# EAGLE design gf130_v2 (EAGLE 9.5.2)
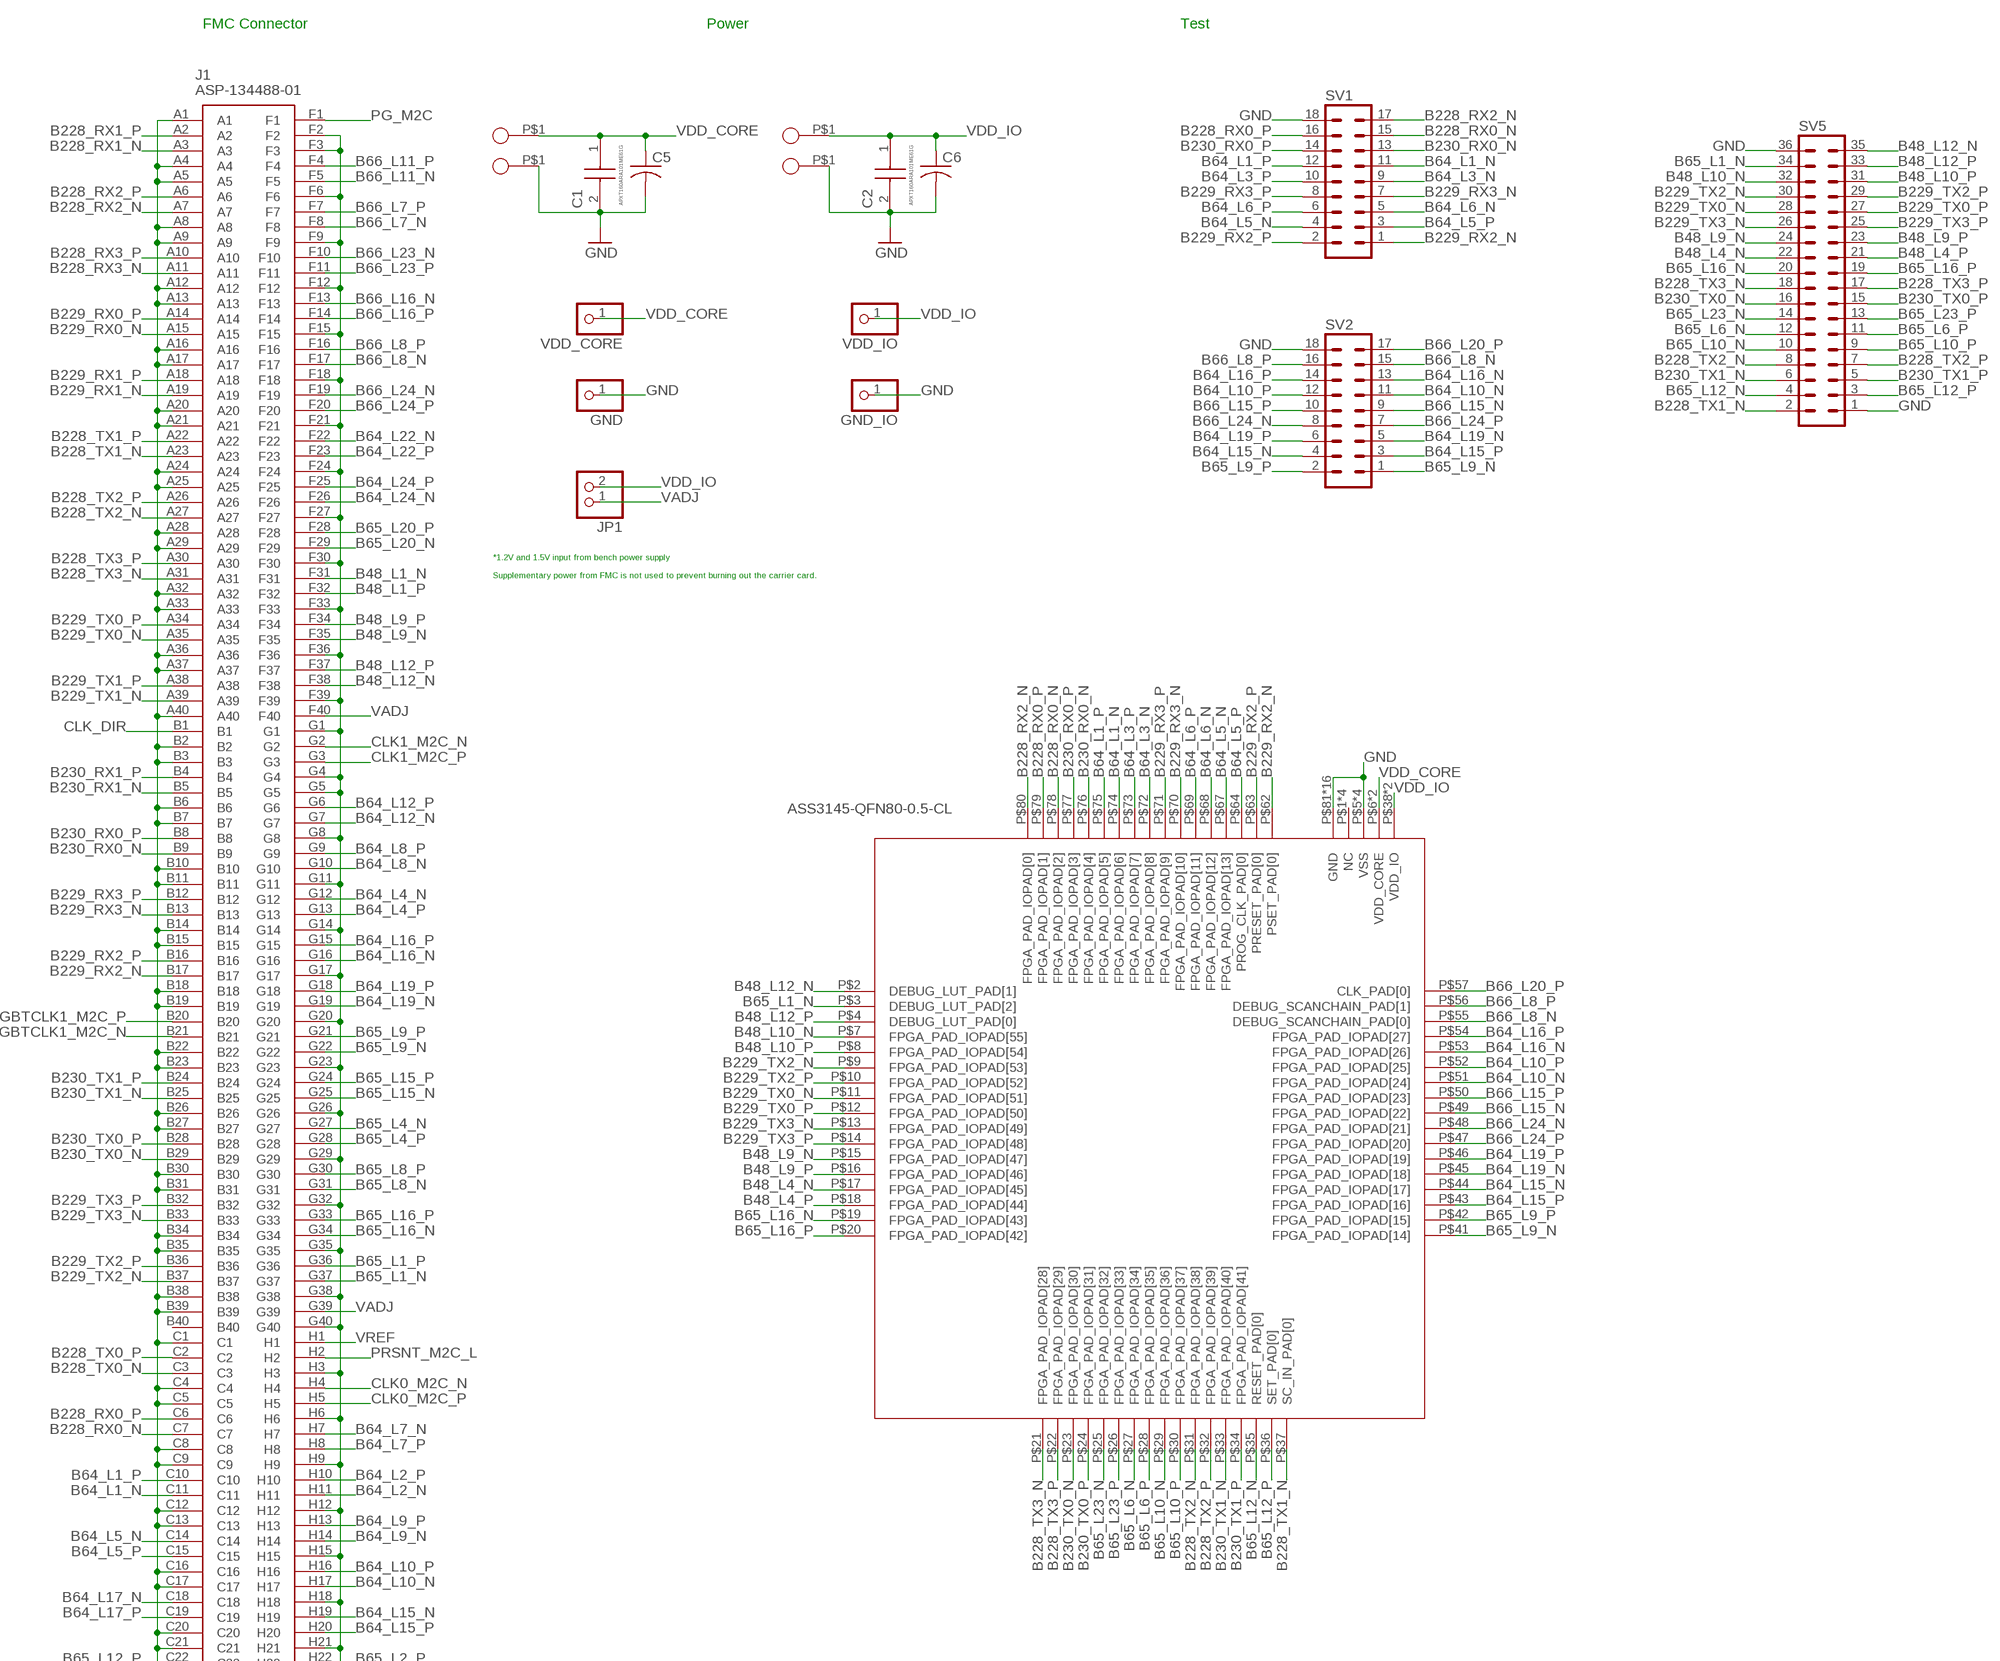
[diagram p0: schematic, sheet 1, part 1 of 2]
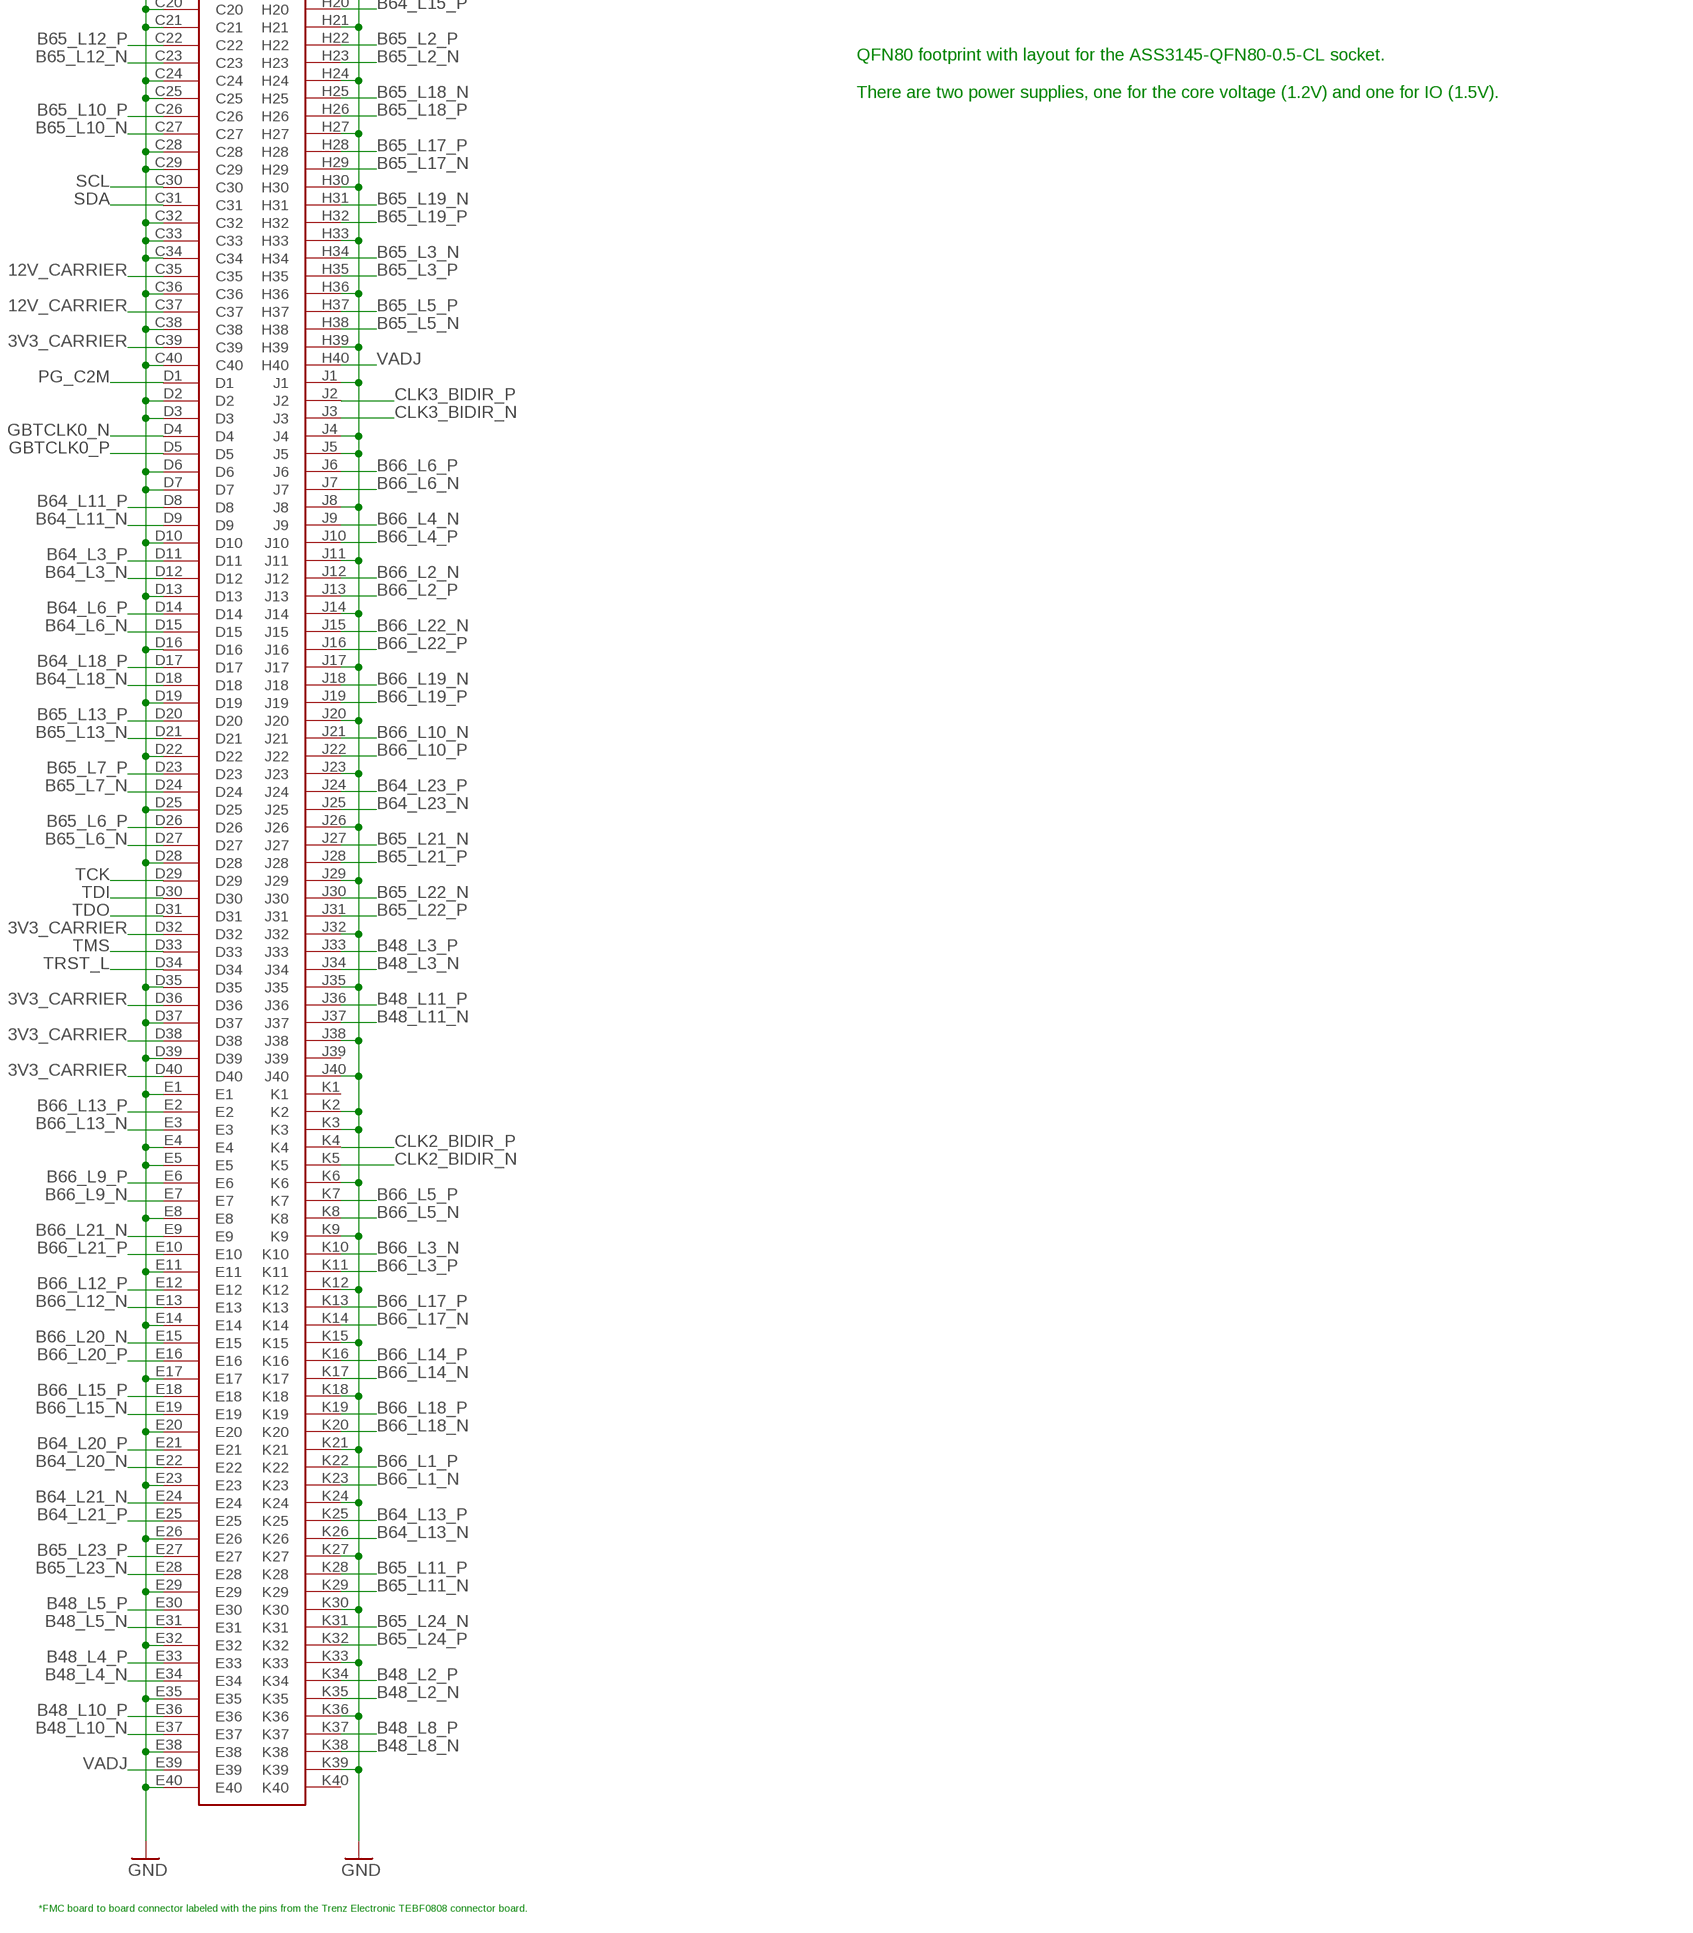
[diagram p1: schematic, sheet 1, part 2 of 2]

## Parts
C1  APXT160ARA101ME61G  [CAPAE530X610N]
C2  APXT160ARA101ME61G  [CAPAE530X610N]
C5  C-USC0805K  [C0805K]
C6  C-USC0805K  [C0805K]
GND  PINHD-1X1  [1X01]
GND_IO  PINHD-1X1  [1X01]
J1  ASP-134488-01  [ASP13448801]
JP1  PINHD-1X2  [1X02]
SV1  MA09-2  [MA09-2]
SV2  MA09-2  [MA09-2]
SV5  MA18-2  [MA18-2]
U$2  QFN80  [GF130]
U$3  BANANA_JACK  [73099]
U$4  BANANA_JACK  [73099]
U$5  BANANA_JACK  [73099]
VDD  BANANA_JACK  [73099]
VDD_CORE  PINHD-1X1  [1X01]
VDD_IO  PINHD-1X1  [1X01]

## Nets
3V3_CARRIER: J1.C39 J1.D32 J1.D36 J1.D38 J1.D40
12V_CARRIER: J1.C35 J1.C37
B48_L1_N: J1.F31
B48_L1_P: J1.F32
B48_L2_N: J1.K35
B48_L2_P: J1.K34
B48_L3_N: J1.J34
B48_L3_P: J1.J33
B48_L4_N: J1.E34 SV5.22 U$2.P$17(FPGA_PAD_IOPAD[45])
B48_L4_P: J1.E33 SV5.21 U$2.P$18(FPGA_PAD_IOPAD[44])
B48_L5_N: J1.E31
B48_L5_P: J1.E30
B48_L8_N: J1.K38
B48_L8_P: J1.K37
B48_L9_N: J1.F35 SV5.24 U$2.P$15(FPGA_PAD_IOPAD[47])
B48_L9_P: J1.F34 SV5.23 U$2.P$16(FPGA_PAD_IOPAD[46])
B48_L10_N: J1.E37 SV5.32 U$2.P$7(FPGA_PAD_IOPAD[55])
B48_L10_P: J1.E36 SV5.31 U$2.P$8(FPGA_PAD_IOPAD[54])
B48_L11_N: J1.J37
B48_L11_P: J1.J36
B48_L12_N: J1.F38 SV5.35 U$2.P$2(DEBUG_LUT_PAD[1])
B48_L12_P: J1.F37 SV5.33 U$2.P$4(DEBUG_LUT_PAD[0])
B64_L1_N: J1.C11 SV1.11 U$2.P$74(FPGA_PAD_IOPAD[6])
B64_L1_P: J1.C10 SV1.12 U$2.P$75(FPGA_PAD_IOPAD[5])
B64_L2_N: J1.H11
B64_L2_P: J1.H10
B64_L3_N: J1.D12 SV1.9 U$2.P$72(FPGA_PAD_IOPAD[8])
B64_L3_P: J1.D11 SV1.10 U$2.P$73(FPGA_PAD_IOPAD[7])
B64_L4_N: J1.G12
B64_L4_P: J1.G13
B64_L5_N: J1.C14 SV1.4 U$2.P$67(FPGA_PAD_IOPAD[13])
B64_L5_P: J1.C15 SV1.3 U$2.P$64(PROG_CLK_PAD[0])
B64_L6_N: J1.D15 SV1.5 U$2.P$68(FPGA_PAD_IOPAD[12])
B64_L6_P: J1.D14 SV1.6 U$2.P$69(FPGA_PAD_IOPAD[11])
B64_L7_N: J1.H7
B64_L7_P: J1.H8
B64_L8_N: J1.G10
B64_L8_P: J1.G9
B64_L9_N: J1.H14
B64_L9_P: J1.H13
B64_L10_N: J1.H17 SV2.11 U$2.P$51(FPGA_PAD_IOPAD[24])
B64_L10_P: J1.H16 SV2.12 U$2.P$52(FPGA_PAD_IOPAD[25])
B64_L11_N: J1.D9
B64_L11_P: J1.D8
B64_L12_N: J1.G7
B64_L12_P: J1.G6
B64_L13_N: J1.K26
B64_L13_P: J1.K25
B64_L15_N: J1.H19 SV2.4 U$2.P$44(FPGA_PAD_IOPAD[17])
B64_L15_P: J1.H20 SV2.3 U$2.P$43(FPGA_PAD_IOPAD[16])
B64_L16_N: J1.G16 SV2.13 U$2.P$53(FPGA_PAD_IOPAD[26])
B64_L16_P: J1.G15 SV2.14 U$2.P$54(FPGA_PAD_IOPAD[27])
B64_L17_N: J1.C18
B64_L17_P: J1.C19
B64_L18_N: J1.D18
B64_L18_P: J1.D17
B64_L19_N: J1.G19 SV2.5 U$2.P$45(FPGA_PAD_IOPAD[18])
B64_L19_P: J1.G18 SV2.6 U$2.P$46(FPGA_PAD_IOPAD[19])
B64_L20_N: J1.E22
B64_L20_P: J1.E21
B64_L21_N: J1.E24
B64_L21_P: J1.E25
B64_L22_N: J1.F22
B64_L22_P: J1.F23
B64_L23_N: J1.J25
B64_L23_P: J1.J24
B64_L24_N: J1.F26
B64_L24_P: J1.F25
B65_L1_N: J1.G37 SV5.34 U$2.P$3(DEBUG_LUT_PAD[2])
B65_L1_P: J1.G36
B65_L2_N: J1.H23
B65_L2_P: J1.H22
B65_L3_N: J1.H34
B65_L3_P: J1.H35
B65_L4_N: J1.G27
B65_L4_P: J1.G28
B65_L5_N: J1.H38
B65_L5_P: J1.H37
B65_L6_N: J1.D27 SV5.12 U$2.P$27(FPGA_PAD_IOPAD[34])
B65_L6_P: J1.D26 SV5.11 U$2.P$28(FPGA_PAD_IOPAD[35])
B65_L7_N: J1.D24
B65_L7_P: J1.D23
B65_L8_N: J1.G31
B65_L8_P: J1.G30
B65_L9_N: J1.G22 SV2.1 U$2.P$41(FPGA_PAD_IOPAD[14])
B65_L9_P: J1.G21 SV2.2 U$2.P$42(FPGA_PAD_IOPAD[15])
B65_L10_N: J1.C27 SV5.10 U$2.P$29(FPGA_PAD_IOPAD[36])
B65_L10_P: J1.C26 SV5.9 U$2.P$30(FPGA_PAD_IOPAD[37])
B65_L11_N: J1.K29
B65_L11_P: J1.K28
B65_L12_N: J1.C23 SV5.4 U$2.P$35(RESET_PAD[0])
B65_L12_P: J1.C22 SV5.3 U$2.P$36(SET_PAD[0])
B65_L13_N: J1.D21
B65_L13_P: J1.D20
B65_L15_N: J1.G25
B65_L15_P: J1.G24
B65_L16_N: J1.G34 SV5.20 U$2.P$19(FPGA_PAD_IOPAD[43])
B65_L16_P: J1.G33 SV5.19 U$2.P$20(FPGA_PAD_IOPAD[42])
B65_L17_N: J1.H29
B65_L17_P: J1.H28
B65_L18_N: J1.H25
B65_L18_P: J1.H26
B65_L19_N: J1.H31
B65_L19_P: J1.H32
B65_L20_N: J1.F29
B65_L20_P: J1.F28
B65_L21_N: J1.J27
B65_L21_P: J1.J28
B65_L22_N: J1.J30
B65_L22_P: J1.J31
B65_L23_N: J1.E28 SV5.14 U$2.P$25(FPGA_PAD_IOPAD[32])
B65_L23_P: J1.E27 SV5.13 U$2.P$26(FPGA_PAD_IOPAD[33])
B65_L24_N: J1.K31
B65_L24_P: J1.K32
B66_L1_N: J1.K23
B66_L1_P: J1.K22
B66_L2_N: J1.J12
B66_L2_P: J1.J13
B66_L3_N: J1.K10
B66_L3_P: J1.K11
B66_L4_N: J1.J9
B66_L4_P: J1.J10
B66_L5_N: J1.K8
B66_L5_P: J1.K7
B66_L6_N: J1.J7
B66_L6_P: J1.J6
B66_L7_N: J1.F8
B66_L7_P: J1.F7
B66_L8_N: J1.F17 SV2.15 U$2.P$55(DEBUG_SCANCHAIN_PAD[0])
B66_L8_P: J1.F16 SV2.16 U$2.P$56(DEBUG_SCANCHAIN_PAD[1])
B66_L9_N: J1.E7
B66_L9_P: J1.E6
B66_L10_N: J1.J21
B66_L10_P: J1.J22
B66_L11_N: J1.F5
B66_L11_P: J1.F4
B66_L12_N: J1.E13
B66_L12_P: J1.E12
B66_L13_N: J1.E3
B66_L13_P: J1.E2
B66_L14_N: J1.K17
B66_L14_P: J1.K16
B66_L15_N: J1.E19 SV2.9 U$2.P$49(FPGA_PAD_IOPAD[22])
B66_L15_P: J1.E18 SV2.10 U$2.P$50(FPGA_PAD_IOPAD[23])
B66_L16_N: J1.F13
B66_L16_P: J1.F14
B66_L17_N: J1.K14
B66_L17_P: J1.K13
B66_L18_N: J1.K20
B66_L18_P: J1.K19
B66_L19_N: J1.J18
B66_L19_P: J1.J19
B66_L20_N: J1.E15
B66_L20_P: J1.E16 SV2.17 U$2.P$57(CLK_PAD[0])
B66_L21_N: J1.E9
B66_L21_P: J1.E10
B66_L22_N: J1.J15
B66_L22_P: J1.J16
B66_L23_N: J1.F10
B66_L23_P: J1.F11
B66_L24_N: J1.F19 SV2.8 U$2.P$48(FPGA_PAD_IOPAD[21])
B66_L24_P: J1.F20 SV2.7 U$2.P$47(FPGA_PAD_IOPAD[20])
B228_RX0_N: J1.C7 SV1.15 U$2.P$78(FPGA_PAD_IOPAD[2])
B228_RX0_P: J1.C6 SV1.16 U$2.P$79(FPGA_PAD_IOPAD[1])
B228_RX1_N: J1.A3
B228_RX1_P: J1.A2
B228_RX2_N: J1.A7 SV1.17 U$2.P$80(FPGA_PAD_IOPAD[0])
B228_RX2_P: J1.A6
B228_RX3_N: J1.A11
B228_RX3_P: J1.A10
B228_TX0_N: J1.C3
B228_TX0_P: J1.C2
B228_TX1_N: J1.A23 SV5.2 U$2.P$37(SC_IN_PAD[0])
B228_TX1_P: J1.A22
B228_TX2_N: J1.A27 SV5.8 U$2.P$31(FPGA_PAD_IOPAD[38])
B228_TX2_P: J1.A26 SV5.7 U$2.P$32(FPGA_PAD_IOPAD[39])
B228_TX3_N: J1.A31 SV5.18 U$2.P$21(FPGA_PAD_IOPAD[28])
B228_TX3_P: J1.A30 SV5.17 U$2.P$22(FPGA_PAD_IOPAD[29])
B229_RX0_N: J1.A15
B229_RX0_P: J1.A14
B229_RX1_N: J1.A19
B229_RX1_P: J1.A18
B229_RX2_N: J1.B17 SV1.1 U$2.P$62(PSET_PAD[0])
B229_RX2_P: J1.B16 SV1.2 U$2.P$63(PRESET_PAD[0])
B229_RX3_N: J1.B13 SV1.7 U$2.P$70(FPGA_PAD_IOPAD[10])
B229_RX3_P: J1.B12 SV1.8 U$2.P$71(FPGA_PAD_IOPAD[9])
B229_TX0_N: J1.A35 SV5.28 U$2.P$11(FPGA_PAD_IOPAD[51])
B229_TX0_P: J1.A34 SV5.27 U$2.P$12(FPGA_PAD_IOPAD[50])
B229_TX1_N: J1.A39
B229_TX1_P: J1.A38
B229_TX2_N: J1.B37 SV5.30 U$2.P$9(FPGA_PAD_IOPAD[53])
B229_TX2_P: J1.B36 SV5.29 U$2.P$10(FPGA_PAD_IOPAD[52])
B229_TX3_N: J1.B33 SV5.26 U$2.P$13(FPGA_PAD_IOPAD[49])
B229_TX3_P: J1.B32 SV5.25 U$2.P$14(FPGA_PAD_IOPAD[48])
B230_RX0_N: J1.B9 SV1.13 U$2.P$76(FPGA_PAD_IOPAD[4])
B230_RX0_P: J1.B8 SV1.14 U$2.P$77(FPGA_PAD_IOPAD[3])
B230_RX1_N: J1.B5
B230_RX1_P: J1.B4
B230_TX0_N: J1.B29 SV5.16 U$2.P$23(FPGA_PAD_IOPAD[30])
B230_TX0_P: J1.B28 SV5.15 U$2.P$24(FPGA_PAD_IOPAD[31])
B230_TX1_N: J1.B25 SV5.6 U$2.P$33(FPGA_PAD_IOPAD[40])
B230_TX1_P: J1.B24 SV5.5 U$2.P$34(FPGA_PAD_IOPAD[41])
CLK0_M2C_N: J1.H4
CLK0_M2C_P: J1.H5
CLK1_M2C_N: J1.G2
CLK1_M2C_P: J1.G3
CLK2_BIDIR_N: J1.K5
CLK2_BIDIR_P: J1.K4
CLK3_BIDIR_N: J1.J3
CLK3_BIDIR_P: J1.J2
CLK_DIR: J1.B1
GBTCLK0_N: J1.D4
GBTCLK0_P: J1.D5
GBTCLK1_M2C_N: J1.B21
GBTCLK1_M2C_P: J1.B20
GND: C1.2(-) C2.2(-) C5.2 C6.2 GND.1 GND_IO.1 J1.A1 J1.A4 J1.A5 J1.A8 J1.A9 J1.A12 J1.A13 J1.A16 J1.A17 J1.A20 J1.A21 J1.A24 J1.A25 J1.A28 J1.A29 J1.A32 J1.A33 J1.A36 J1.A37 J1.A40 J1.B2 J1.B3 J1.B6 J1.B7 J1.B10 J1.B11 J1.B14 J1.B15 J1.B18 J1.B19 J1.B22 J1.B23 J1.B26 J1.B27 J1.B30 J1.B31 J1.B34 J1.B35 J1.B38 J1.B39 J1.C1 J1.C4 J1.C5 J1.C8 J1.C9 J1.C12 J1.C13 J1.C16 J1.C17 J1.C20 J1.C21 J1.C24 J1.C25 J1.C28 J1.C29 J1.C32 J1.C33 J1.C34 J1.C36 J1.C38 J1.C40 J1.D2 J1.D3 J1.D6 J1.D7 J1.D10 J1.D13 J1.D16 J1.D19 J1.D22 J1.D25 J1.D28 J1.D35 J1.D37 J1.D39 J1.E1 J1.E4 J1.E5 J1.E8 J1.E11 J1.E14 J1.E17 J1.E20 J1.E23 J1.E26 J1.E29 J1.E32 J1.E35 J1.E38 J1.E40 J1.F2 J1.F3 J1.F6 J1.F9 J1.F12 J1.F15 J1.F18 J1.F21 J1.F24 J1.F27 J1.F30 J1.F33 J1.F36 J1.F39 J1.G1 J1.G4 J1.G5 J1.G8 J1.G11 J1.G14 J1.G17 J1.G20 J1.G23 J1.G26 J1.G29 J1.G32 J1.G35 J1.G38 J1.G40 J1.H3 J1.H6 J1.H9 J1.H12 J1.H15 J1.H18 J1.H21 J1.H24 J1.H27 J1.H30 J1.H33 J1.H36 J1.H39 J1.J1 J1.J4 J1.J5 J1.J8 J1.J11 J1.J14 J1.J17 J1.J20 J1.J23 J1.J26 J1.J29 J1.J32 J1.J35 J1.J38 J1.J40 J1.K2 J1.K3 J1.K6 J1.K9 J1.K12 J1.K15 J1.K18 J1.K21 J1.K24 J1.K27 J1.K30 J1.K33 J1.K36 J1.K39 SV1.18 SV2.18 SV5.1 SV5.36 U$2.P$5(VSS) U$2.P$39(VSS) U$2.P$59(VSS) U$2.P$65(VSS) U$2.P$81(GND) U$2.P$82(GND) U$2.P$83(GND) U$2.P$84(GND) U$2.P$85(GND) U$2.P$86(GND) U$2.P$87(GND) U$2.P$88(GND) U$2.P$89(GND) U$2.P$90(GND) U$2.P$91(GND) U$2.P$92(GND) U$2.P$93(GND) U$2.P$94(GND) U$2.P$95(GND) U$2.P$96(GND) U$3.P$1 U$5.P$1
PG_C2M: J1.D1
PG_M2C: J1.F1
PRSNT_M2C_L: J1.H2
SCL: J1.C30
SDA: J1.C31
TCK: J1.D29
TDI: J1.D30
TDO: J1.D31
TMS: J1.D33
TRST_L: J1.D34
VADJ: J1.E39 J1.F40 J1.G39 J1.H40 JP1.1
VDD_CORE: C1.1(+) C5.1 U$2.P$6(VDD_CORE) U$2.P$58(VDD_CORE) VDD.P$1 VDD_CORE.1
VDD_IO: C2.1(+) C6.1 JP1.2 U$2.P$38(VDD_IO) U$2.P$66(VDD_IO) U$4.P$1 VDD_IO.1
VREF: J1.H1
Unconnected: J1.B40 J1.J39 J1.K1 J1.K40 U$2.P$1(NC) U$2.P$40(NC) U$2.P$60(NC) U$2.P$61(NC)

## Notes on the sheet
- FMC Connector | Power | Test
- *1.2V and 1.5V input from bench power supply
  
  Supplementary power from FMC is not used to prevent burning out the carrier card.
- QFN80 footprint with layout for the ASS3145-QFN80-0.5-CL socket. 
  
  There are two power supplies, one for the core voltage (1.2V) and one for IO (1.5V).
- *FMC board to board connector labeled with the pins from the Trenz Electronic TEBF0808 connector board.

## Power pins joined to a net without a drawn wire
GND: U$3.P$2(GND) U$3.P$3(GND) U$3.P$4(GND) U$3.P$5(GND) U$4.P$2(GND) U$4.P$3(GND) U$4.P$4(GND) U$4.P$5(GND) U$5.P$2(GND) U$5.P$3(GND) U$5.P$4(GND) U$5.P$5(GND) VDD.P$2(GND) VDD.P$3(GND) VDD.P$4(GND) VDD.P$5(GND)

## Library data of the parts
C1 C2 = SamacSys_Parts:APXT160ARA101ME61G: Aluminum Organic Polymer Capacitors 100uF 16V Source: Datasheet; DESCRIPTION: Aluminum Organic Polymer Capacitors 100uF 16V; HEIGHT: 6.1mm; MANUFACTURER_NAME: United Chemi-Con; MANUFACTURER_PART_NUMBER: APXT160ARA101ME61G; MOUSER_PART_NUMBER: 661-APXT160A101ME61G; MOUSER_PRICE-STOCK: https://www.mouser.co.uk/ProductDetail/United-Chemi-Con/APXT160ARA101ME61G?qs=GBLSl2Akirsip577GuQBxg%3D%3D
C5 C6 = rcl:C-US: CAPACITOR, American symbol; SPICEPREFIX: C
GND GND_IO VDD_CORE VDD_IO = pinhead:PINHD-1X1: PIN HEADER
J1 = SamacSys_Parts:ASP-134488-01: SAMTEC - ASP-134488-01 - CONN, VITA 57 FMC, HEADER, 400POS, 10ROW Source: Datasheet <http://suddendocs.samtec.com/prints/asp-134488-01-mkt.pdf>; DESCRIPTION: SAMTEC - ASP-134488-01 - CONN, VITA 57 FMC, HEADER, 400POS, 10ROW; HEIGHT: 7.11mm; MANUFACTURER_NAME: SAMTEC; MANUFACTURER_PART_NUMBER: ASP-134488-01; MOUSER_PART_NUMBER: 200-ASP-134488-01; MOUSER_PRICE-STOCK: https://www.mouser.co.uk/ProductDetail/Samtec/ASP-134488-01?qs=jyzYFa4oMQiB2Frr%252B13AUg%3D%3D
JP1 = pinhead:PINHD-1X2: PIN HEADER
SV1 SV2 = con-lstb:MA09-2: PIN HEADER; OC_FARNELL: unknown; OC_NEWARK: unknown
SV5 = con-lstb:MA18-2: PIN HEADER; OC_FARNELL: unknown; OC_NEWARK: unknown
U$2 = ASS3145-QFN80-0.5-CL:QFN80
U$3-U$5 VDD = 73099:BANANA_JACK

## Board
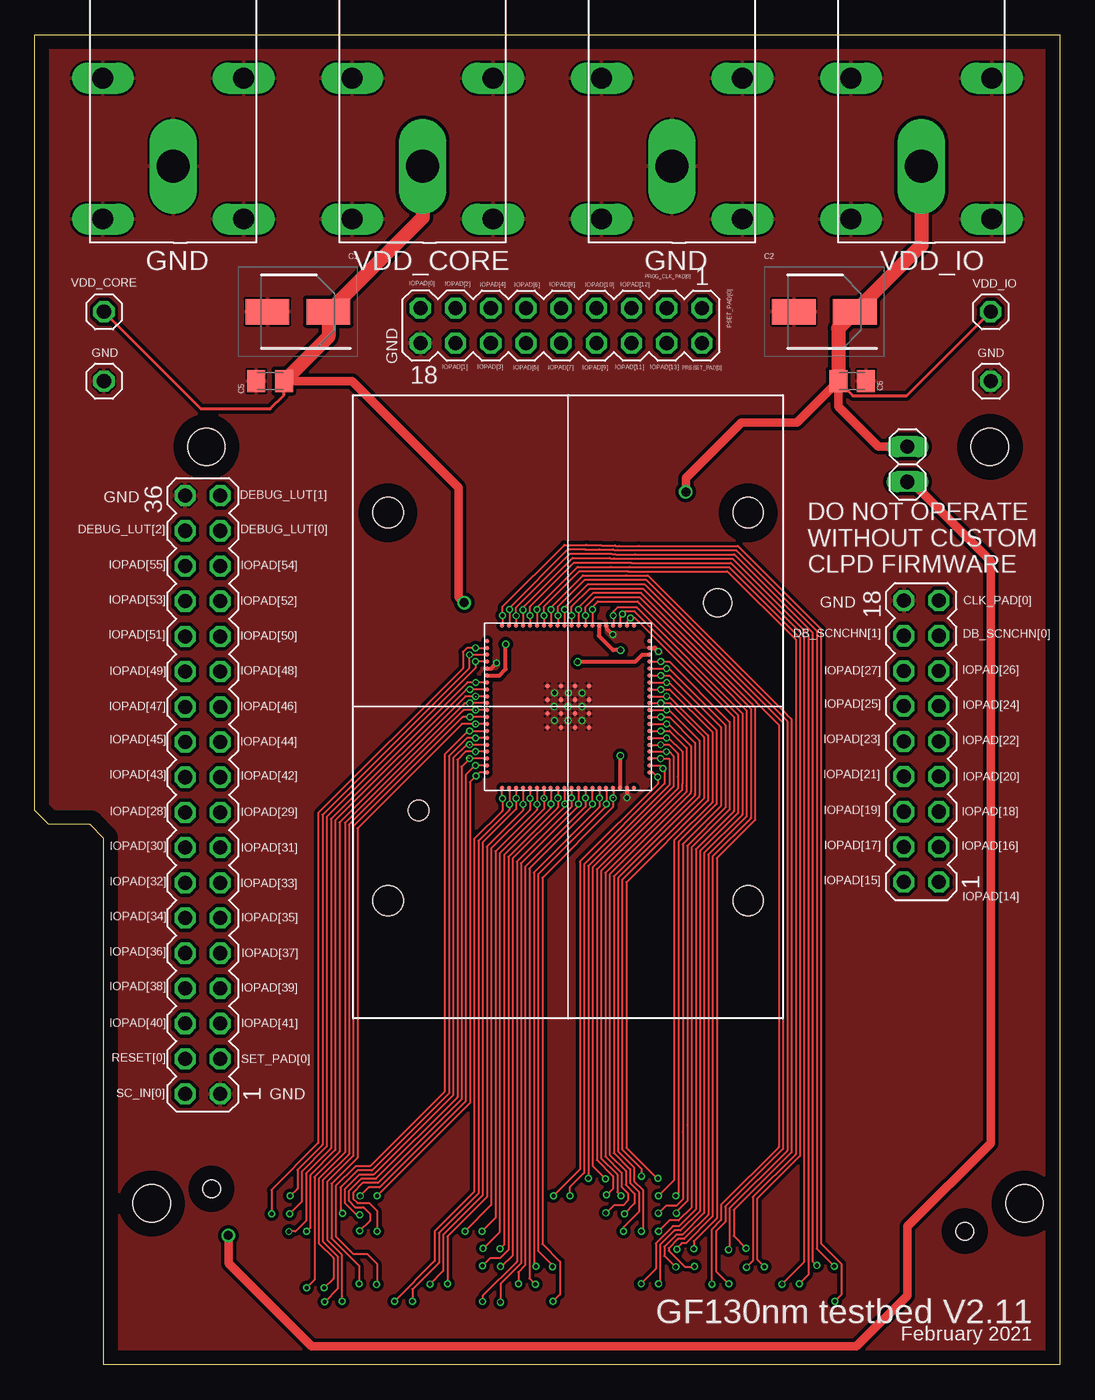
[diagram p2: board, top side]
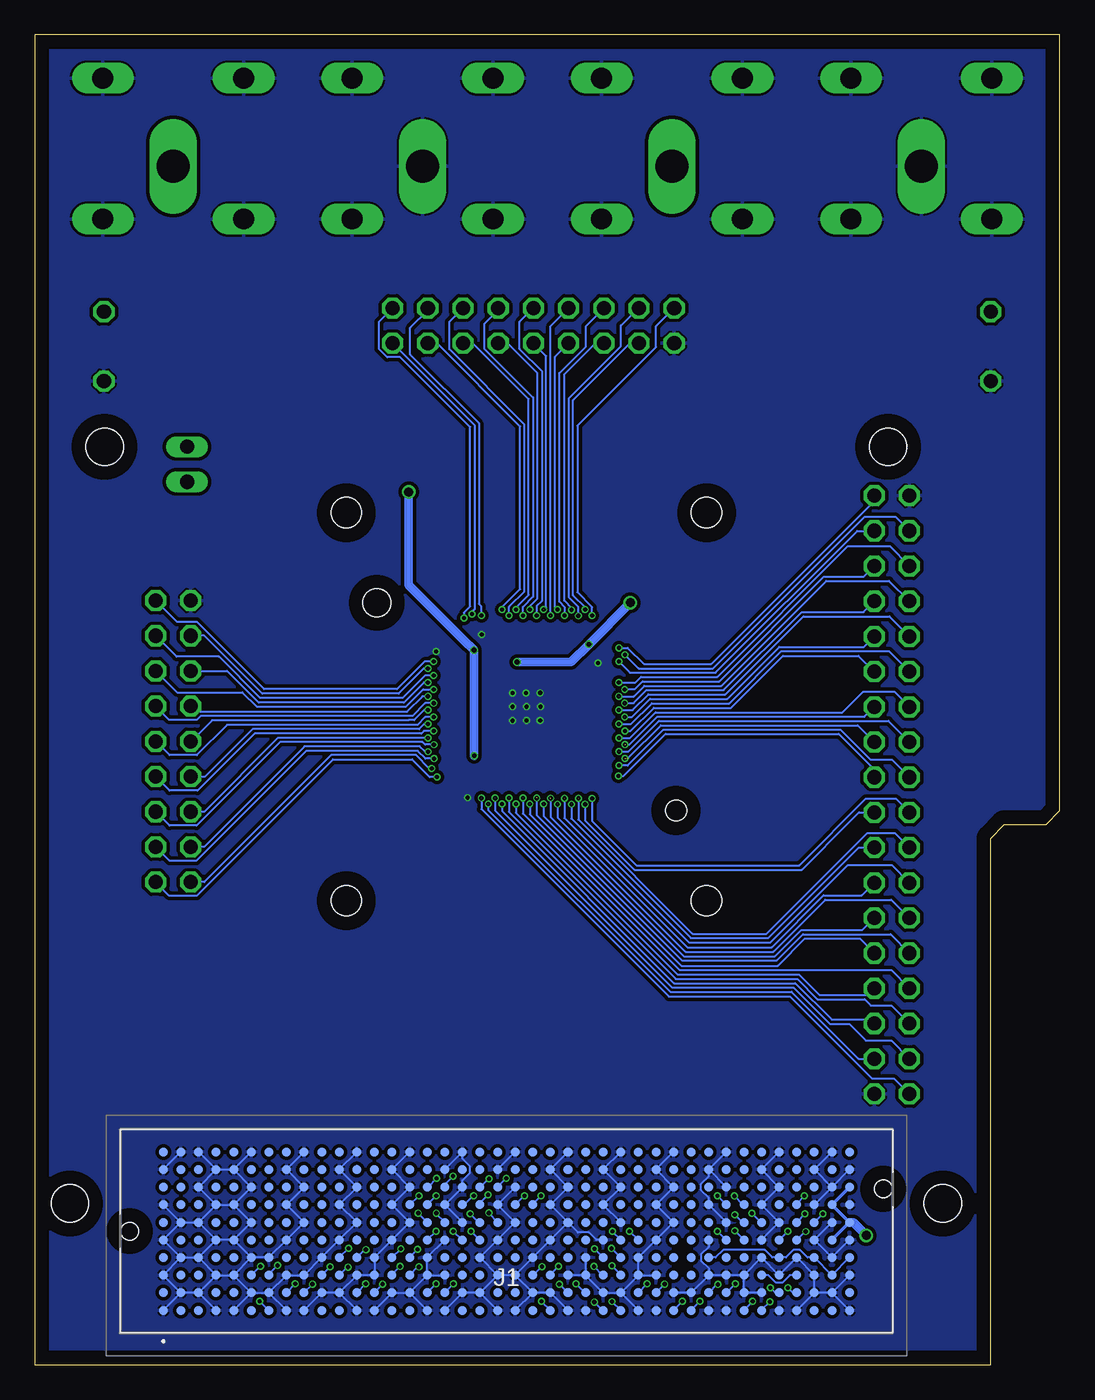
[diagram p3: board, bottom side, seen from below]

Size 74 x 96 mm. Coordinates in mm from the lower left corner, seen from the top.
Outline: 5,0 5,38 4,39 1,39 0,40 0,96 74,96 74,0 5,0
Copper layers (1*16): Top 0.035mm / dielectric 1.5mm / Bottom 0.035mm
Design rules "default *": minimum track width 6mil, minimum drill 0.3mm, track to track 6mil, track to pad 6mil, pad to pad 6mil, via to via 6mil, smd to smd 6mil, copper to edge 40mil, drill to drill 6mil, minimum pad ring 10mil, minimum via ring 4mil, stop-mask expansion 4mil, vias tented up to drill 0mil, thermal gap 6mil
Holes 2.7 mm at 8.45,11.65 71.45,11.65 68.95,66.25 12.4,66.25

### Footprints (pad centres in the part's own frame; a part is rotated, then mirrored left to right if it is on the bottom)
CAPAE530X610N = smd 3.15 x 1.85: 1 -2.2,0; 2 2.2,0
C0805K = smd 1.3 x 1.6: 1 -1,0; 2 1,0
1X01 = drill 1.016 octagon: 1 0,0
ASP13448801 = smd 0.64 x 0.64: A1 24.765,5.715; A2 23.495,5.715; A3 22.225,5.715; A4 20.955,5.715; A5 19.685,5.715; A6 18.415,5.715; A7 17.145,5.715; A8 15.875,5.715; A9 14.605,5.715; A10 13.335,5.715; A11 12.065,5.715; A12 10.795,5.715; A13 9.525,5.715; A14 8.255,5.715; A15 6.985,5.715; A16 5.715,5.715; A17 4.445,5.715; A18 3.175,5.715; A19 1.905,5.715; A20 0.635,5.715; A21 -0.635,5.715; A22 -1.905,5.715; A23 -3.175,5.715; A24 -4.445,5.715; A25 -5.715,5.715; A26 -6.985,5.715; A27 -8.255,5.715; A28 -9.525,5.715; A29 -10.795,5.715; A30 -12.065,5.715; A31 -13.335,5.715; A32 -14.605,5.715; A33 -15.875,5.715; A34 -17.145,5.715; A35 -18.415,5.715; A36 -19.685,5.715; A37 -20.955,5.715; A38 -22.225,5.715; A39 -23.495,5.715; A40 -24.765,5.715; B1 24.765,4.445; B2 23.495,4.445; B3 22.225,4.445; B4 20.955,4.445; B5 19.685,4.445; B6 18.415,4.445; B7 17.145,4.445; B8 15.875,4.445; B9 14.605,4.445; B10 13.335,4.445; B11 12.065,4.445; B12 10.795,4.445; B13 9.525,4.445; B14 8.255,4.445; B15 6.985,4.445; B16 5.715,4.445; B17 4.445,4.445; B18 3.175,4.445; B19 1.905,4.445; B20 0.635,4.445; B21 -0.635,4.445; B22 -1.905,4.445; B23 -3.175,4.445; B24 -4.445,4.445; B25 -5.715,4.445; B26 -6.985,4.445; B27 -8.255,4.445; B28 -9.525,4.445; B29 -10.795,4.445; B30 -12.065,4.445; B31 -13.335,4.445; B32 -14.605,4.445; B33 -15.875,4.445; B34 -17.145,4.445; B35 -18.415,4.445; B36 -19.685,4.445; B37 -20.955,4.445; B38 -22.225,4.445; B39 -23.495,4.445; B40 -24.765,4.445; C1 24.765,3.175; C2 23.495,3.175; C3 22.225,3.175; C4 20.955,3.175; C5 19.685,3.175; C6 18.415,3.175; C7 17.145,3.175; C8 15.875,3.175; C9 14.605,3.175; C10 13.335,3.175; C11 12.065,3.175; C12 10.795,3.175; C13 9.525,3.175; C14 8.255,3.175; C15 6.985,3.175; C16 5.715,3.175; C17 4.445,3.175; C18 3.175,3.175; C19 1.905,3.175; C20 0.635,3.175; C21 -0.635,3.175; C22 -1.905,3.175; C23 -3.175,3.175; C24 -4.445,3.175; C25 -5.715,3.175; C26 -6.985,3.175; C27 -8.255,3.175; C28 -9.525,3.175; C29 -10.795,3.175; C30 -12.065,3.175; C31 -13.335,3.175; C32 -14.605,3.175; C33 -15.875,3.175; C34 -17.145,3.175; C35 -18.415,3.175; C36 -19.685,3.175; C37 -20.955,3.175; C38 -22.225,3.175; C39 -23.495,3.175; C40 -24.765,3.175; D1 24.765,1.905; D2 23.495,1.905; D3 22.225,1.905; D4 20.955,1.905; D5 19.685,1.905; D6 18.415,1.905; D7 17.145,1.905; D8 15.875,1.905; D9 14.605,1.905; D10 13.335,1.905; D11 12.065,1.905; D12 10.795,1.905; D13 9.525,1.905; D14 8.255,1.905; D15 6.985,1.905; D16 5.715,1.905; D17 4.445,1.905; D18 3.175,1.905; D19 1.905,1.905; D20 0.635,1.905; D21 -0.635,1.905; D22 -1.905,1.905; D23 -3.175,1.905; D24 -4.445,1.905; D25 -5.715,1.905; D26 -6.985,1.905; D27 -8.255,1.905; D28 -9.525,1.905; D29 -10.795,1.905; D30 -12.065,1.905; D31 -13.335,1.905; D32 -14.605,1.905; D33 -15.875,1.905; D34 -17.145,1.905; D35 -18.415,1.905; D36 -19.685,1.905; D37 -20.955,1.905; D38 -22.225,1.905; D39 -23.495,1.905; D40 -24.765,1.905; E1 24.765,0.635; E2 23.495,0.635; E3 22.225,0.635; E4 20.955,0.635; E5 19.685,0.635; E6 18.415,0.635; E7 17.145,0.635; E8 15.875,0.635; E9 14.605,0.635; E10 13.335,0.635; E11 12.065,0.635; E12 10.795,0.635; E13 9.525,0.635; E14 8.255,0.635; E15 6.985,0.635; E16 5.715,0.635; E17 4.445,0.635; E18 3.175,0.635; E19 1.905,0.635; E20 0.635,0.635; E21 -0.635,0.635; E22 -1.905,0.635; E23 -3.175,0.635; E24 -4.445,0.635; E25 -5.715,0.635; E26 -6.985,0.635; E27 -8.255,0.635; E28 -9.525,0.635; E29 -10.795,0.635; E30 -12.065,0.635; E31 -13.335,0.635; E32 -14.605,0.635; E33 -15.875,0.635; E34 -17.145,0.635; E35 -18.415,0.635; E36 -19.685,0.635; E37 -20.955,0.635; E38 -22.225,0.635; E39 -23.495,0.635; E40 -24.765,0.635; F1 24.765,-0.635; F2 23.495,-0.635; F3 22.225,-0.635; F4 20.955,-0.635; F5 19.685,-0.635; F6 18.415,-0.635; F7 17.145,-0.635; F8 15.875,-0.635; F9 14.605,-0.635; F10 13.335,-0.635; F11 12.065,-0.635; F12 10.795,-0.635; F13 9.525,-0.635; F14 8.255,-0.635; F15 6.985,-0.635; F16 5.715,-0.635; F17 4.445,-0.635; F18 3.175,-0.635; F19 1.905,-0.635; F20 0.635,-0.635; F21 -0.635,-0.635; F22 -1.905,-0.635; F23 -3.175,-0.635; F24 -4.445,-0.635; F25 -5.715,-0.635; F26 -6.985,-0.635; F27 -8.255,-0.635; F28 -9.525,-0.635; F29 -10.795,-0.635; F30 -12.065,-0.635; F31 -13.335,-0.635; F32 -14.605,-0.635; F33 -15.875,-0.635; F34 -17.145,-0.635; F35 -18.415,-0.635; F36 -19.685,-0.635; F37 -20.955,-0.635; F38 -22.225,-0.635; F39 -23.495,-0.635; F40 -24.765,-0.635; G1 24.765,-1.905; G2 23.495,-1.905; G3 22.225,-1.905; G4 20.955,-1.905; G5 19.685,-1.905; G6 18.415,-1.905; G7 17.145,-1.905; G8 15.875,-1.905; G9 14.605,-1.905; G10 13.335,-1.905; G11 12.065,-1.905; G12 10.795,-1.905; G13 9.525,-1.905; G14 8.255,-1.905; G15 6.985,-1.905; G16 5.715,-1.905; G17 4.445,-1.905; G18 3.175,-1.905; G19 1.905,-1.905; G20 0.635,-1.905; G21 -0.635,-1.905; G22 -1.905,-1.905; G23 -3.175,-1.905; G24 -4.445,-1.905; G25 -5.715,-1.905; G26 -6.985,-1.905; G27 -8.255,-1.905; G28 -9.525,-1.905; G29 -10.795,-1.905; G30 -12.065,-1.905; G31 -13.335,-1.905; G32 -14.605,-1.905; G33 -15.875,-1.905; G34 -17.145,-1.905; G35 -18.415,-1.905; G36 -19.685,-1.905; G37 -20.955,-1.905; G38 -22.225,-1.905; G39 -23.495,-1.905; G40 -24.765,-1.905; H1 24.765,-3.175; H2 23.495,-3.175; H3 22.225,-3.175; H4 20.955,-3.175; H5 19.685,-3.175; H6 18.415,-3.175; H7 17.145,-3.175; H8 15.875,-3.175; H9 14.605,-3.175; H10 13.335,-3.175; H11 12.065,-3.175; H12 10.795,-3.175; H13 9.525,-3.175; H14 8.255,-3.175; H15 6.985,-3.175; H16 5.715,-3.175; H17 4.445,-3.175; H18 3.175,-3.175; H19 1.905,-3.175; H20 0.635,-3.175; H21 -0.635,-3.175; H22 -1.905,-3.175; H23 -3.175,-3.175; H24 -4.445,-3.175; H25 -5.715,-3.175; H26 -6.985,-3.175; H27 -8.255,-3.175; H28 -9.525,-3.175; H29 -10.795,-3.175; H30 -12.065,-3.175; H31 -13.335,-3.175; H32 -14.605,-3.175; H33 -15.875,-3.175; H34 -17.145,-3.175; H35 -18.415,-3.175; H36 -19.685,-3.175; H37 -20.955,-3.175; H38 -22.225,-3.175; H39 -23.495,-3.175; H40 -24.765,-3.175; J1 24.765,-4.445; J2 23.495,-4.445; J3 22.225,-4.445; J4 20.955,-4.445; J5 19.685,-4.445; J6 18.415,-4.445; J7 17.145,-4.445; J8 15.875,-4.445; J9 14.605,-4.445; J10 13.335,-4.445; J11 12.065,-4.445; J12 10.795,-4.445; J13 9.525,-4.445; J14 8.255,-4.445; J15 6.985,-4.445; J16 5.715,-4.445; J17 4.445,-4.445; J18 3.175,-4.445; J19 1.905,-4.445; J20 0.635,-4.445; J21 -0.635,-4.445; J22 -1.905,-4.445; J23 -3.175,-4.445; J24 -4.445,-4.445; J25 -5.715,-4.445; J26 -6.985,-4.445; J27 -8.255,-4.445; J28 -9.525,-4.445; J29 -10.795,-4.445; J30 -12.065,-4.445; J31 -13.335,-4.445; J32 -14.605,-4.445; J33 -15.875,-4.445; J34 -17.145,-4.445; J35 -18.415,-4.445; J36 -19.685,-4.445; J37 -20.955,-4.445; J38 -22.225,-4.445; J39 -23.495,-4.445; J40 -24.765,-4.445; K1 24.765,-5.715; K2 23.495,-5.715; K3 22.225,-5.715; K4 20.955,-5.715; K5 19.685,-5.715; K6 18.415,-5.715; K7 17.145,-5.715; K8 15.875,-5.715; K9 14.605,-5.715; K10 13.335,-5.715; K11 12.065,-5.715; K12 10.795,-5.715; K13 9.525,-5.715; K14 8.255,-5.715; K15 6.985,-5.715; K16 5.715,-5.715; K17 4.445,-5.715; K18 3.175,-5.715; K19 1.905,-5.715; K20 0.635,-5.715; K21 -0.635,-5.715; K22 -1.905,-5.715; K23 -3.175,-5.715; K24 -4.445,-5.715; K25 -5.715,-5.715; K26 -6.985,-5.715; K27 -8.255,-5.715; K28 -9.525,-5.715; K29 -10.795,-5.715; K30 -12.065,-5.715; K31 -13.335,-5.715; K32 -14.605,-5.715; K33 -15.875,-5.715; K34 -17.145,-5.715; K35 -18.415,-5.715; K36 -19.685,-5.715; K37 -20.955,-5.715; K38 -22.225,-5.715; K39 -23.495,-5.715; K40 -24.765,-5.715 | hole 1.27: 27.189,0; -27.191,-3.05
1X02 = drill 1.016 long: 1 -1.27,0; 2 1.27,0
MA09-2 = drill 1.016 octagon: 1 -10.16,-1.27; 2 -10.16,1.27; 3 -7.62,-1.27; 4 -7.62,1.27; 5 -5.08,-1.27; 6 -5.08,1.27; 7 -2.54,-1.27; 8 -2.54,1.27; 9 0,-1.27; 10 0,1.27; 11 2.54,-1.27; 12 2.54,1.27; 13 5.08,-1.27; 14 5.08,1.27; 15 7.62,-1.27; 16 7.62,1.27; 17 10.16,-1.27; 18 10.16,1.27
MA18-2 = drill 1.016 octagon: 1 -21.59,-1.27; 2 -21.59,1.27; 3 -19.05,-1.27; 4 -19.05,1.27; 5 -16.51,-1.27; 6 -16.51,1.27; 7 -13.97,-1.27; 8 -13.97,1.27; 9 -11.43,-1.27; 10 -11.43,1.27; 11 -8.89,-1.27; 12 -8.89,1.27; 13 -6.35,-1.27; 14 -6.35,1.27; 15 -3.81,-1.27; 16 -3.81,1.27; 17 -1.27,-1.27; 18 -1.27,1.27; 19 1.27,-1.27; 20 1.27,1.27; 21 3.81,-1.27; 22 3.81,1.27; 23 6.35,-1.27; 24 6.35,1.27; 25 8.89,-1.27; 26 8.89,1.27; 27 11.43,-1.27; 28 11.43,1.27; 29 13.97,-1.27; 30 13.97,1.27; 31 16.51,-1.27; 32 16.51,1.27; 33 19.05,-1.27; 34 19.05,1.27; 35 21.59,-1.27; 36 21.59,1.27
GF130 = smd 0.34 x 0.34: P$1 9.64,-17.75; P$2 9.64,-18.25; P$3 9.64,-18.75; P$4 9.64,-19.25; P$5 9.64,-19.75; P$6 9.64,-20.25; P$7 9.64,-20.75; P$8 9.64,-21.25; P$9 9.64,-21.75; P$10 9.64,-22.25; P$11 9.64,-22.75; P$12 9.64,-23.25; P$13 9.64,-23.75; P$14 9.64,-24.25; P$15 9.64,-24.75; P$16 9.64,-25.25; P$17 9.64,-25.75; P$18 9.64,-26.25; P$19 9.64,-26.75; P$20 9.64,-27.25; P$21 10.75,-28.36; P$22 11.25,-28.36; P$23 11.75,-28.36; P$24 12.25,-28.36; P$25 12.75,-28.36; P$26 13.25,-28.36; P$27 13.75,-28.36; P$28 14.25,-28.36; P$29 14.75,-28.36; P$30 15.25,-28.36; P$31 15.75,-28.36; P$32 16.25,-28.36; P$33 16.75,-28.36; P$34 17.25,-28.36; P$35 17.75,-28.36; P$36 18.25,-28.36; P$37 18.75,-28.36; P$38 19.25,-28.36; P$39 19.75,-28.36; P$40 20.25,-28.36; P$41 21.37,-27.25; P$42 21.37,-26.75; P$43 21.37,-26.25; P$44 21.37,-25.75; P$45 21.37,-25.25; P$46 21.37,-24.75; P$47 21.37,-24.25; P$48 21.37,-23.75; P$49 21.37,-23.25; P$50 21.37,-22.75; P$51 21.37,-22.25; P$52 21.37,-21.75; P$53 21.37,-21.25; P$54 21.37,-20.75; P$55 21.37,-20.25; P$56 21.37,-19.75; P$57 21.37,-19.25; P$58 21.37,-18.75; P$59 21.37,-18.25; P$60 21.37,-17.75; P$61 20.25,-16.65; P$62 19.75,-16.65; P$63 19.25,-16.65; P$64 18.75,-16.65; P$65 18.25,-16.65; P$66 17.75,-16.65; P$67 17.25,-16.65; P$68 16.75,-16.65; P$69 16.25,-16.65; P$70 15.75,-16.65; P$71 15.25,-16.65; P$72 14.75,-16.65; P$73 14.25,-16.65; P$74 13.75,-16.65; P$75 13.25,-16.65; P$76 12.75,-16.65; P$77 12.25,-16.65; P$78 11.75,-16.65; P$79 11.25,-16.65; P$80 10.75,-16.65; P$81 16,-22; P$82 16,-23; P$83 15,-23; P$84 15,-22; P$85 15,-21; P$86 16,-21; P$87 17,-21; P$88 17,-22; P$89 17,-23; P$90 17,-24; P$91 16,-24; P$92 15,-24; P$93 14,-24; P$94 14,-23; P$95 14,-22; P$96 14,-21 | hole 1.5: 4.7,-30 | hole 2.2: 2.5,-36.5; 28.5,-36.5; 28.5,-8.5; 2.5,-8.5 | hole 2: 26.3,-15
73099 = drill 2.4 long: P$1 6,5.5 | drill 1.5 long: P$2 11.08,11.86; P$3 0.92,11.86; P$4 0.92,1.7; P$5 11.08,1.7

### Placement (x,y rotation side)
C1  19,76 180 top
C2  57,76 180 top
C5  17,71 180 top
C6  59,71 0 top
GND  5,71 0 top
GND_IO  69,71 0 top
J1  39.95,9.65 180 bottom
JP1  63,65 90 top
SV1  38,75 180 top
SV2  64,45 90 top
SV5  12.13,41.14 90 top
U$2  23,70 0 top
U$3  40,81 0 top
U$4  58,81 0 top
U$5  4,81 0 top
VDD  22,81 0 top
VDD_CORE  5,76 0 top
VDD_IO  69,76 0 top

### Tracks (layer width: path | path; a pad name or v marks a point on that pad's centre or on a via)
3V3_CARRIER
  Bottom 0.152: J1.D40 J1.C39 J1.D38 18.22,7.75 18.77,8.29 19.22,8.29 19.77,7.75 J1.D36 20.76,7.75 21.31,8.29 24.3,8.29 24.85,7.75 J1.D32
12V_CARRIER
  Bottom 0.152: J1.C37 19.49,6.47 20.04,5.93 20.49,5.93 21.04,6.47 J1.C35
B48_L4_N  (via drill 0.3)  (1 unrouted)
  Top 0.152: v31.82,44.25 31.73,44.25 | 31.73,44.25 31.1,44.25 30.51,43.66 30.51,19.31 24.62,13.43 23.55,13.43 22.68,12.55 22.68,11.84 23.14,11.38 23.74,11.38 24.2,10.91 24.2,10.4 v23.47,9.67 | U$2.P$17 31.73,44.25
  Bottom 0.152: v31.82,44.25 31.15,44.25 28.93,46.47 12.38,46.47 SV5.22 | v23.47,9.67 J1.E34
B48_L4_P  (via drill 0.3)  (1 unrouted)
  Top 0.152: v24.71,9.63 24.71,11.13 24.16,11.69 23.3,11.69 22.98,12 22.98,12.43 23.68,13.12 24.78,13.12 30.81,19.15 30.81,43.16 v31.39,43.74 v31.39,43.75 U$2.P$18
  Bottom 0.152: 31.17,43.78 28.8,46.15 14.6,46.15 SV5.21 | J1.E33 24.09,9.02 v24.71,9.63
B48_L9_N  (via drill 0.3)  (1 unrouted)
  Top 0.152: v31.83,45.25 31.73,45.25 | 31.73,45.25 31.21,45.25 29.9,43.94 29.9,19.58 24.35,14.03 23.3,14.03 22.07,12.8 22.07,11.09 v22.23,10.93 | U$2.P$15 31.73,45.25
  Bottom 0.152: v31.83,45.25 31.03,45.25 29.19,47.09 15.69,47.09 14.19,48.59 11.96,48.59 SV5.24 | v22.23,10.93 21.59,10.29 J1.F35
B48_L9_P  (via drill 0.3)  (1 unrouted)
  Top 0.152: v23.47,10.84 23.24,10.84 22.38,11.71 22.38,12.68 23.43,13.73 24.48,13.73 30.2,19.45 30.2,43.79 31.16,44.75 31.39,44.75 v31.4,44.76 v31.4,44.75 U$2.P$16
  Bottom 0.152: v31.4,44.75 v31.4,44.76 31.08,44.76 29.06,46.78 14.11,46.78 SV5.23 | v23.47,10.84 22.91,10.29 J1.F34
B48_L10_N  (via drill 0.3)
  Top 0.152: v18.35,9.62 v18.35,9.63 18.83,9.63 19.58,10.38 19.58,13.82 21.39,15.63 21.39,39.41 31.23,49.25 v31.84,49.25 U$2.P$7
  Bottom 0.152: v31.84,49.25 30.63,49.25 30.23,49.65 24.73,49.65 15.3,59.08 12.29,59.08 SV5.32 | v18.35,9.62 18.39,9.62 J1.E37
B48_L10_P  (via drill 0.3)
  Top 0.152: v19.64,9.63 19.89,9.88 19.89,13.69 21.7,15.5 21.7,39.28 31.17,48.75 v31.41,48.75 U$2.P$8
  Bottom 0.152: v19.64,9.63 20.25,9.02 J1.E36 | v31.41,48.75 30.69,48.75 30.11,49.33 24.59,49.33 17.03,56.89 14.16,56.89 SV5.31
B48_L12_N  (via drill 0.3)
  Top 0.152: v17.1,10.9 17.1,12.63 20.48,16.01 20.48,39.83 30.91,50.26 30.91,51.45 31.21,51.75 v31.82,51.75 U$2.P$2
  Bottom 0.152: v31.82,51.75 31.21,51.75 30.04,50.58 25.17,50.58 13.4,62.35 SV5.35 | v17.1,10.9 v17.11,10.9 J1.F38
B48_L12_P  (via drill 0.3)
  Top 0.152: v18.39,10.9 v18.4,10.9 19.28,11.78 19.28,13.94 21.09,15.75 21.09,39.56 31.83,50.31 v31.83,50.76 v31.84,50.75 U$2.P$4
  Bottom 0.152: v18.39,10.9 19,10.3 J1.F37 | v31.83,50.76 31.04,49.96 24.86,49.96 14.63,60.19 SV5.33
B64_L1_N  (via drill 0.3)  (1 unrouted)
  Top 0.152: U$2.P$74 v36.76,54.07 v36.76,54.08 36.76,54.72 39.32,57.28 41.41,57.28 41.41,57.27 42.84,57.27 49.99,57.27 54.93,52.33 54.93,15.21 51.84,12.12 51.84,7.5 v51.39,7.05 v51.38,7.05
  Bottom 0.152: v36.76,54.07 v36.76,54.08 36.76,74.97 SV1.11 | v51.38,7.05 51.44,7.05 J1.C11
B64_L1_P  (via drill 0.3)
  Top 0.152: U$2.P$75 v36.26,54.5 36.26,54.66 39.19,57.59 41.56,57.59 41.57,57.58 42.96,57.58 42.97,57.57 50.12,57.57 55.23,52.46 55.23,15.08 52.15,11.99 52.15,7.62 v52.67,7.09 v52.66,7.08
  Bottom 0.152: SV1.12 36.44,72.75 36.44,54.68 v36.26,54.5 | v52.66,7.08 52.67,7.08 J1.C10
B64_L3_N  (via drill 0.3)
  Top 0.152: U$2.P$72 v37.76,54.08 v37.76,54.09 37.76,54.71 39.71,56.66 44.14,56.66 54,46.8 54,46.79 54.3,46.49 54.3,46.45 54.32,46.44 54.32,15.46 50.16,11.3 50.16,8.39 v50.09,8.32
  Bottom 0.152: SV1.9 38.99,75.28 38.99,73.32 37.39,71.72 37.39,55.13 37.76,54.75 v37.76,54.09 | v50.09,8.32 50.17,8.32 J1.D12
B64_L3_P  (via drill 0.3)  (1 unrouted)
  Top 0.152: U$2.P$73 v37.26,54.51 37.26,54.66 39.57,56.97 42.71,56.97 42.72,56.97 44.27,56.97 54.3,46.93 54.3,46.92 54.61,46.61 54.61,46.58 54.62,46.56 54.62,15.33 50.46,11.17 50.46,9.3 v51.35,8.41
  Bottom 0.152: v37.26,54.51 37.08,54.69 37.08,72.81 SV1.10 | v51.35,8.41 J1.D11
B64_L5_N  (via drill 0.3)
  Top 0.152: U$2.P$67 v40.26,54.5 40.26,54.71 40.65,55.1 43.51,55.1 49.66,48.95 49.66,48.94 51.38,47.22 51.38,39.6 51.38,39.58 48.63,36.83 48.63,10.85 46.87,9.09 46.45,9.09 45.78,8.41 45.78,8.23 46.93,7.08 47.63,7.08 v47.63,7.1
  Bottom 0.152: SV1.4 44.96,73.73 38.96,67.73 38.96,55.98 40.26,54.68 v40.26,54.5 | v47.63,7.1 48.2,6.53 J1.C14
B64_L5_P  (via drill 0.3)
  Top 0.152: v46.27,7.06 46.25,7.06 45.46,7.85 45.46,8.52 46.32,9.39 46.74,9.39 48.32,10.97 48.32,36.95 51.07,39.7 51.07,39.72 51.08,39.73 51.08,47.02 43.42,54.68 42.09,54.68 41.76,54.35 v41.76,54.08 U$2.P$64
  Bottom 0.152: v41.76,54.08 41.76,54.74 41.93,54.91 41.93,67.95 46.9,72.92 46.9,74.85 45.62,76.13 SV1.3 | v46.27,7.06 46.35,7.06 J1.C15
B64_L6_N  (via drill 0.3)
  Top 0.152: U$2.P$68 v39.76,54.07 v39.75,54.08 39.75,54.68 40.48,55.41 43.63,55.41 43.64,55.41 51.47,47.57 51.47,47.56 51.69,47.34 51.69,39.48 51.68,39.47 51.68,39.45 48.93,36.7 48.93,10.72 47,8.78 46.71,8.78 46.37,8.44 v46.37,8.33
  Bottom 0.152: SV1.5 44.07,75.28 44.07,73.29 38.65,67.87 38.65,55.82 39.76,54.71 39.75,54.7 v39.75,54.08 | v46.37,8.33 46.94,7.76 J1.D15
B64_L6_P  (via drill 0.3)
  Top 0.152: U$2.P$69 v39.26,54.51 39.26,54.64 40.34,55.72 43.75,55.72 43.76,55.72 43.76,55.71 51.77,47.7 51.77,47.69 51.99,47.47 51.99,39.35 51.99,39.34 51.99,39.32 49.24,36.57 49.24,10.59 47.57,8.92 v47.57,8.38
  Bottom 0.152: SV1.6 42.38,73.73 38.35,69.7 38.35,55.57 39.25,54.67 v39.25,54.52 v39.26,54.51 | v47.57,8.38 J1.D14
B64_L10_N  (via drill 0.3)
  Top 0.152: U$2.P$51 v45.19,47.75 45.85,47.75 48.29,45.31 48.29,40.86 42.41,34.98 42.41,15.54 43.79,14.16 v43.79,13.62
  Bottom 0.152: SV2.11 64.28,46.55 62.29,46.55 62.01,46.83 46.73,46.83 45.81,47.75 v45.19,47.75 | v43.79,13.62 44.4,13.02 J1.H17
B64_L10_P  (via drill 0.3)
  Top 0.152: U$2.P$52 v45.62,48.25 45.79,48.25 48.61,45.43 48.61,40.72 42.71,34.82 42.71,15.66 44.93,13.45 v44.99,13.45
  Bottom 0.152: SV2.12 62.34,47.15 47.12,47.15 46.02,48.25 v45.62,48.25 | v44.99,13.45 45.62,12.82 J1.H16
B64_L15_N  (via drill 0.3)
  Top 0.152: U$2.P$44 v45.61,44.25 45.81,44.25 46.12,43.93 46.12,41.73 40.27,35.88 40.27,14.37 v41.21,13.43 v41.2,13.43
  Bottom 0.152: SV2.4 61.78,37.38 54.53,44.63 46.22,44.63 45.84,44.25 v45.61,44.25 | v41.2,13.43 41.26,13.43 J1.H19
B64_L15_P  (via drill 0.3)
  Top 0.152: U$2.P$43 v45.18,43.75 45.79,43.75 45.82,43.72 45.82,41.86 39.97,36.01 v39.97,13.47 v39.96,13.47
  Bottom 0.152: SV2.3 64.27,36.38 62.33,36.38 54.39,44.32 46.36,44.32 45.79,43.75 v45.18,43.75 | v39.96,13.47 40.59,12.85 J1.H20
B64_L16_N  (via drill 0.3)
  Top 0.152: U$2.P$53 v45.19,48.75 45.83,48.75 48.92,45.66 48.92,40.6 48.91,40.59 46.15,37.83 46.15,13.33 v45.02,12.2 v45.02,12.21
  Bottom 0.152: SV2.13 63.73,48.54 59.01,48.54 57.95,47.48 47.22,47.48 45.95,48.75 v45.19,48.75 | v45.02,12.21 J1.G16
B64_L16_P  (via drill 0.3)
  Top 0.152: U$2.P$54 v45.62,49.25 45.78,49.25 49.23,45.8 49.23,40.47 49.22,40.47 46.48,37.72 46.48,12.41 v46.27,12.21
  Bottom 0.152: SV2.14 60.11,50.08 57.83,47.8 47.35,47.8 45.9,49.25 v45.62,49.25 | v46.27,12.21 46.92,11.55 J1.G15
B64_L19_N  (via drill 0.3)
  Top 0.152: U$2.P$45 v45.18,44.75 v45.19,44.75 45.8,44.75 46.43,44.12 46.43,42.43 46.43,41.6 40.58,35.76 40.58,14.78 41.75,13.61 41.75,12.71 v41.29,12.25 v41.28,12.26
  Bottom 0.152: SV2.5 64.27,38.92 62.31,38.92 56.29,44.94 46.01,44.94 45.82,44.75 v45.19,44.75 | v41.28,12.26 41.85,11.69 J1.G19
B64_L19_P  (via drill 0.3)  (1 unrouted)
  Top 0.152: U$2.P$46 v45.62,45.25 45.74,45.25 46.74,44.25 46.74,41.93 46.73,41.92 46.73,41.48 40.88,35.63 40.88,14.91 42.05,13.74 42.05,12.46 v42.31,12.2
  Bottom 0.152: v45.62,45.25 56.45,45.25 61.78,39.92 SV2.6 | v42.31,12.2 42.37,12.2 43.02,11.55 J1.G18
B65_L1_N  (via drill 0.3)
  Top 0.152: v18.43,12.2 v18.44,12.19 18.97,12.72 18.97,14.07 20.78,15.88 20.78,39.69 31.34,50.25 31.34,51.19 v31.4,51.25 U$2.P$3
  Bottom 0.152: v31.4,51.25 30.42,50.27 25.04,50.27 14.09,61.22 11.89,61.22 SV5.34 | v18.43,12.2 19,11.63 J1.G37
B65_L6_N  (via drill 0.3)  (1 unrouted)
  Top 0.152: v36.75,40.89 36.75,40.76 | 36.75,40.76 36.75,40.1 33.57,36.92 33.57,9.58 32.37,8.38 v32.35,8.39 | U$2.P$27 36.76,40.77 36.75,40.76
  Bottom 0.152: v36.76,40.9 v36.75,40.89 36.75,39.55 27.01,29.81 20.69,29.81 16.94,33.56 12.17,33.56 SV5.12 | v32.35,8.39 J1.D27
B65_L6_P  (via drill 0.3)  (1 unrouted)
  Top 0.152: v33.6,8.38 33.88,8.66 33.88,36.8 37.26,40.18 v37.26,40.47 U$2.P$28
  Bottom 0.152: v37.26,40.47 37.26,39.61 27.14,29.49 20.56,29.49 18.67,31.38 14.27,31.38 SV5.11 | v33.6,8.38 J1.D26
B65_L9_N  (via drill 0.3)
  Top 0.152: U$2.P$41 44.64,42.75 v44.97,42.42 44.97,41.94 39.35,36.32 39.35,14.11 v37.45,12.21
  Bottom 0.152: v44.97,42.42 45.48,42.42 46.75,43.69 52.46,43.69 62.3,33.85 64.28,33.85 SV2.1 | v37.45,12.21 38.05,11.62 J1.G22
B65_L9_P  (via drill 0.3)
  Top 0.152: U$2.P$42 45.14,43.25 v45.34,43.05 45.47,42.92 45.47,41.94 39.66,36.12 39.66,13.86 38.65,12.85 v38.65,12.19
  Bottom 0.152: SV2.2 61.75,34.84 52.59,44 46.47,44 45.52,43.05 v45.34,43.05 | v38.65,12.19 38.68,12.19 J1.G21
B65_L10_N  (via drill 0.3)  (1 unrouted)
  Top 0.152: v32.32,7.14 32.88,7.7 33.6,7.7 34.19,8.29 34.19,36.66 37.76,40.23 v37.76,40.9 U$2.P$29
  Bottom 0.152: v37.76,40.9 v37.77,40.89 37.77,39.68 27.27,29.18 20.43,29.18 18.54,31.07 12.22,31.07 SV5.10 | v32.32,7.14 31.7,6.51 J1.C27
B65_L10_P  (via drill 0.3)  (1 unrouted)
  Top 0.152: v33.63,7.1 33.71,7.1 34.49,7.88 34.49,36.53 38.26,40.3 v38.26,40.48 U$2.P$30
  Bottom 0.152: v38.26,40.48 38.26,39.74 27.33,28.8 20.37,28.8 18.41,30.76 14.45,30.76 SV5.9 | v33.63,7.1 33.01,6.47 J1.C26
B65_L12_N  (via drill 0.3)  (1 unrouted)
  Top 0.152: v40.76,40.9 40.76,40.76 | 40.76,40.76 40.76,40.26 36.03,35.53 36.03,7.27 v36.19,7.11 | U$2.P$35 40.76,40.76
  Bottom 0.152: v40.76,40.9 40.76,40 28,27.24 19.23,27.24 16.59,24.6 15.2,24.6 14.01,23.41 12.18,23.41 SV5.4 | v36.19,7.11 36.77,6.52 J1.C23
B65_L12_P  (via drill 0.3)  (1 unrouted)
  Top 0.152: v37.37,7.09 37.37,7.18 36.33,8.22 36.33,35.4 41.26,40.33 v41.26,40.47 U$2.P$36
  Bottom 0.152: v41.26,40.47 41.26,40.05 28.13,26.92 19.37,26.92 14.54,22.09 SV5.3 | v37.37,7.09 37.43,7.09 J1.C22
B65_L16_N  (via drill 0.3)
  Top 0.152: v23.5,12.19 v23.5,12.2 24.11,12.8 24.89,12.8 31.12,19.03 31.12,42.58 31.79,43.25 v31.82,43.25 U$2.P$19
  Bottom 0.152: v23.5,12.19 22.88,11.55 J1.G34 | v31.82,43.25 31.2,43.25 28.61,45.84 15.84,45.84 15.22,45.23 13.68,43.68 12.13,43.68 SV5.20
B65_L16_P  (via drill 0.3)
  Top 0.152: v24.72,12.21 v24.73,12.21 31.42,18.9 31.42,42.06 v31.86,42.5 32.11,42.75 U$2.P$20
  Bottom 0.152: v24.72,12.21 24.07,11.56 J1.G33 | v31.86,42.5 31.49,42.5 28.46,45.53 15.96,45.53 13.4,42.97 SV5.19
B65_L23_N  (via drill 0.3)  (1 unrouted)
  Top 0.152: v31.06,9.65 32.95,11.54 32.95,37.26 35.75,40.06 35.75,40.88 v35.76,40.89 U$2.P$25
  Bottom 0.152: v35.76,40.89 35.76,39.47 26.77,30.48 20.91,30.48 15.32,36.07 12.14,36.07 SV5.14 | v31.06,9.65 J1.E28
B65_L23_P  (via drill 0.3)  (1 unrouted)
  Top 0.152: v32.3,9.64 33.26,10.6 33.26,37.06 36.25,40.06 v36.25,40.46 v36.26,40.46 U$2.P$26
  Bottom 0.152: v36.26,40.46 36.26,39.5 26.9,30.14 20.8,30.14 17.06,33.88 14.31,33.88 SV5.13 | v32.3,9.64 32.3,9.62 J1.E27
B66_L8_N  (via drill 0.3)
  Top 0.152: U$2.P$55 v45.19,49.75 45.81,49.75 49.53,46.03 49.53,40.33 46.79,37.59 46.79,16.82 46.8,16.8 46.8,11.96 46.33,11.49 45.57,11.49 v45.02,10.94 v45.01,10.95
  Bottom 0.152: SV2.15 63.76,51.11 60.69,51.11 57.71,48.13 47.45,48.13 45.83,49.75 v45.19,49.75 | v45.01,10.95 45.01,10.9 J1.F17
B66_L8_P  (via drill 0.3)
  Top 0.152: U$2.P$56 v45.62,50.25 45.77,50.25 49.85,46.17 49.85,40.21 47.1,37.46 47.1,17.31 47.1,11.83 46.31,11.04 v46.31,10.95
  Bottom 0.152: SV2.16 61.75,52.62 57.58,48.45 47.73,48.45 45.93,50.25 v45.62,50.25 | v46.31,10.95 45.66,10.3 J1.F16
B66_L15_N  (via drill 0.3)
  Top 0.152: U$2.P$49 v45.19,46.75 45.81,46.75 47.67,44.89 47.67,41.67 47.66,41.66 47.66,41.23 47.65,41.22 47.65,41.1 41.8,35.25 41.8,15.29 42.97,14.12 42.97,13.13 43.61,12.49 43.61,11.04 42.51,9.94 v42.51,9.65
  Bottom 0.152: SV2.9 64.27,44 62.3,44 60.11,46.19 46.37,46.19 45.81,46.75 v45.19,46.75 | v42.51,9.65 41.88,9.02 J1.E19
B66_L15_P  (via drill 0.3)
  Top 0.152: U$2.P$50 v45.62,47.25 45.78,47.25 47.98,45.05 47.98,41.09 47.95,41.06 47.95,40.97 42.1,35.12 42.1,15.41 43.27,14.24 43.27,13.26 43.91,12.62 43.91,9.78 v43.78,9.65 v43.78,9.64
  Bottom 0.152: SV2.10 61.2,46.52 47,46.52 46.6,46.52 45.88,47.25 v45.62,47.25 | v43.78,9.64 43.16,9.02 J1.E18
B66_L20_P  (via drill 0.3)
  Top 0.152: U$2.P$57 v45.19,50.75 45.81,50.75 50.16,46.4 50.16,40.08 47.41,37.33 47.41,11.35 46.48,10.42 45.81,10.42 v45.04,9.65
  Bottom 0.152: SV2.17 63.72,53.61 62.28,53.61 57.44,48.77 47.84,48.77 45.86,50.75 v45.19,50.75 | v45.04,9.65 v45.04,9.64 J1.E16
B66_L24_N  (via drill 0.3)
  Top 0.152: U$2.P$48 v45.62,46.25 45.76,46.25 47.35,44.66 47.35,41.35 47.34,41.34 47.34,41.23 41.49,35.38 41.49,15.16 42.66,13.99 42.66,13 43.3,12.36 43.3,11.65 v42.56,10.91 v42.56,10.9
  Bottom 0.152: SV2.8 61.7,42.45 58.27,45.88 46.25,45.88 45.88,46.25 v45.62,46.25 | v42.56,10.9 41.95,10.29 J1.F19
B66_L24_P  (via drill 0.3)
  Top 0.152: U$2.P$47 v45.19,45.75 45.82,45.75 47.05,44.52 47.05,42.05 47.05,41.8 47.04,41.8 47.04,41.35 41.19,35.5 41.19,15.03 42.36,13.86 42.36,12.85 42.82,12.39 42.82,11.86 42.49,11.53 41.82,11.53 41.24,10.95 v41.23,10.95 v41.22,10.96
  Bottom 0.152: SV2.7 64.26,41.45 62.24,41.45 58.13,45.56 46.09,45.56 45.9,45.75 v45.19,45.75 | v41.22,10.96 41.22,10.92 J1.F20
B228_RX0_N  (via drill 0.3)
  Top 0.152: v56.47,7.17 56.15,7.49 56.15,52.84 50.49,58.49 43.35,58.49 43.34,58.49 41.95,58.49 41.94,58.5 41.68,58.5 41.65,58.53 40.65,58.53 40.63,58.55 38.64,58.55 34.76,54.67 v34.76,54.06 U$2.P$78
  Bottom 0.152: v34.76,54.06 34.76,54.7 35.46,55.4 35.46,69.74 31.69,73.51 31.69,75 30.42,76.27 SV1.15 | v56.47,7.17 57.09,6.54 J1.C7
B228_RX0_P  (via drill 0.3)
  Top 0.152: U$2.P$79 v34.26,54.5 34.26,54.63 38.49,58.86 39.73,58.86 39.73,58.85 40.76,58.85 40.77,58.84 41.77,58.84 41.81,58.8 42.07,58.8 42.08,58.8 43.47,58.8 43.47,58.79 50.62,58.79 56.45,52.96 56.45,8.38 v57.71,7.12 v57.7,7.12
  Bottom 0.152: SV1.16 31.03,73.73 35.14,69.62 35.14,55.53 34.26,54.65 v34.26,54.51 v34.26,54.5 | v57.7,7.12 57.73,7.12 J1.C6
B228_RX2_N  (via drill 0.3)
  Top 0.152: v57.75,4.58 v57.76,4.58 58.24,5.06 58.24,7.28 56.76,8.76 56.76,53.09 50.75,59.1 43.6,59.1 43.59,59.1 42.2,59.1 42.2,59.11 41.93,59.11 41.9,59.14 40.9,59.14 40.88,59.16 39.86,59.16 39.77,59.16 39.76,59.18 38.23,59.18 33.76,54.71 v33.76,54.08 U$2.P$80
  Bottom 0.152: v33.76,54.08 33.76,54.69 34.83,55.76 34.83,67.78 29.15,73.46 29.15,74.95 SV1.17 | v57.75,4.58 57.1,3.94 J1.A7
B228_TX1_N  (via drill 0.3)  (1 unrouted)
  Top 0.152: v41.76,40.9 41.76,40.76 | 41.76,40.76 41.76,40.28 36.64,35.16 36.64,8.72 37.92,7.44 37.92,5.08 v37.42,4.58 v37.41,4.59 | U$2.P$37 41.76,40.76
  Bottom 0.152: v41.76,40.9 41.76,40.11 28.23,26.59 19.49,26.59 13.57,20.67 12,20.67 10.88,19.55 SV5.2 | v37.41,4.59 37.41,4.57 J1.A23
B228_TX2_N  (via drill 0.3)  (1 unrouted)
  Top 0.152: v32.33,4.57 v32.34,4.57 32.34,4.98 34.8,7.44 34.8,36.32 38.76,40.28 v38.76,40.91 U$2.P$31
  Bottom 0.152: v38.76,40.91 38.76,39.79 27.46,28.49 12.18,28.49 SV5.8 | v32.33,4.57 J1.A27
B228_TX2_P  (via drill 0.3)  (1 unrouted)
  Top 0.152: v33.61,4.53 33.63,4.53 33.63,5.84 35.1,7.31 35.1,36.19 39.26,40.35 v39.26,40.49 U$2.P$32
  Bottom 0.152: v39.26,40.49 39.26,39.84 27.6,28.17 18.84,28.17 17.36,26.69 13.88,26.69 SV5.7 | v33.61,4.53 33.02,3.94 J1.A26
B228_TX3_N  (via drill 0.3)
  Top 0.152: v25.97,4.59 28.88,7.5 28.88,9.64 31.73,12.49 31.73,37.94 33.76,39.98 v33.76,40.88 v33.75,40.89 U$2.P$21
  Bottom 0.152: v33.76,40.88 33.76,39.25 30.57,36.06 18.81,36.06 14,40.87 11.86,40.87 SV5.18 | v25.97,4.59 J1.A31
B228_TX3_P  (via drill 0.3)
  Top 0.152: v27.26,4.58 v27.27,4.58 27.27,5.46 29.18,7.37 29.18,9.51 32.03,12.36 32.03,37.82 34.26,40.05 v34.26,40.46 34.26,41.63 U$2.P$22
  Bottom 0.152: v27.26,4.58 27.89,3.96 J1.A30 | v34.26,40.46 | v34.26,40.46 34.26,39.3 30.7,35.73 18.64,35.73 15.19,39.19 15.14,39.23 14.5,39.87 SV5.17
B229_RX2_N  (via drill 0.3)
  Top 0.152: U$2.P$62 42.76,53.63 v43.01,53.89 43.02,53.9 43.33,53.9 50.47,46.76 50.47,39.98 50.47,39.95 47.71,37.2 47.71,11.22 46.49,10 46.07,10 44.83,8.76 44.83,6.94 43.78,5.89 v43.78,5.86
  Bottom 0.152: SV1.1 49.15,75.28 49.15,73.32 48.55,72.72 47.61,72.72 42.57,67.68 42.57,54.73 43.01,54.29 v43.01,53.89 | v43.78,5.86 44.4,5.25 J1.B17
B229_RX2_P  (via drill 0.3)
  Top 0.152: U$2.P$63 42.26,54.03 v42.42,54.19 42.6,54.37 43.3,54.37 50.77,46.9 50.77,39.85 50.77,39.83 48.02,37.08 48.02,11.1 46.62,9.7 46.2,9.7 45.15,8.65 45.15,5.95 v45.04,5.84
  Bottom 0.152: SV1.2 42.26,67.83 42.26,54.51 42.42,54.35 v42.42,54.19 | v45.04,5.84 J1.B16
B229_RX3_N  (via drill 0.3)
  Top 0.152: v48.88,5.83 48.88,9.78 49.55,10.45 49.55,11.55 53.71,15.71 53.71,46.19 52.08,47.82 43.89,56.01 43.88,56.02 40.08,56.02 38.76,54.71 v38.76,54.08 U$2.P$70
  Bottom 0.152: v38.76,54.08 38.76,54.7 38.02,55.44 38.02,69.81 41.53,73.32 41.53,75.14 40.54,76.13 SV1.7 | v48.88,5.83 49.48,5.24 J1.B13
B229_RX3_P  (via drill 0.3)
  Top 0.152: U$2.P$71 v38.26,54.52 38.26,54.67 39.94,56.35 44.01,56.35 54,46.36 54,46.33 54.02,46.31 54.02,15.58 49.85,11.42 49.85,10.32 49.19,9.65 49.19,6.75 50.08,5.85 v50.1,5.85
  Bottom 0.152: SV1.8 39.88,73.73 37.71,71.56 37.71,55.31 38.26,54.76 v38.26,54.52 | v50.1,5.85 J1.B12
B229_TX0_N  (via drill 0.3)  (1 unrouted)
  Top 0.152: v20.94,4.56 v20.95,4.56 21.86,5.47 21.86,7.84 20.8,8.91 20.8,13.31 22.7,15.21 22.7,38.98 30.96,47.25 v31.84,47.25 U$2.P$11
  Bottom 0.152: v31.84,47.25 30.84,47.25 29.71,48.38 24.15,48.38 18.51,54.02 12.31,54.02 SV5.28 | v20.94,4.56 21.54,3.96 J1.A35
B229_TX0_P  (via drill 0.3)  (1 unrouted)
  Top 0.152: v22.18,4.58 v22.17,4.58 22.17,7.97 21.11,9.02 21.11,13.2 23,15.08 23,38.86 30.89,46.75 v31.41,46.75 U$2.P$12
  Bottom 0.152: v31.41,46.75 30.89,46.75 29.58,48.06 24.01,48.06 20.25,51.82 14.15,51.82 SV5.27 | v22.18,4.58 22.18,4.56 J1.A34
B229_TX2_N  (via drill 0.3)  (1 unrouted)
  Top 0.152: v19.63,5.57 20.19,6.13 20.19,13.56 22,15.37 22,39.15 31.09,48.24 v31.83,48.24 v31.84,48.25 U$2.P$9
  Bottom 0.152: v31.84,48.25 30.75,48.25 30,49 24.44,49 16.86,56.58 12.33,56.58 SV5.30 | v19.63,5.57 19.27,5.21 J1.B37
B229_TX2_P  (via drill 0.3)  (1 unrouted)
  Top 0.152: v20.9,5.56 21.56,6.22 21.56,7.71 20.5,8.78 20.5,13.44 22.39,15.33 22.39,39.11 31.03,47.75 v31.41,47.75 U$2.P$10
  Bottom 0.152: v31.41,47.75 30.78,47.75 29.84,48.69 24.28,48.69 18.64,54.33 14.18,54.33 SV5.29 | v20.9,5.56 20.88,5.56 20.52,5.21 J1.B36
B229_TX3_N  (via drill 0.3)  (1 unrouted)
  Top 0.152: v23.42,5.86 v23.41,5.86 23.41,7.16 21.42,9.15 21.42,13.07 23.31,14.96 23.31,38.72 30.84,46.25 v31.84,46.25 U$2.P$13
  Bottom 0.152: v31.84,46.25 30.95,46.25 29.46,47.74 23.87,47.74 20.1,51.51 12.34,51.51 SV5.26 | v23.42,5.86 J1.B33
B229_TX3_P  (via drill 0.3)
  Top 0.152: v24.68,5.8 24.7,5.8 24.7,7.3 24,8 23,8 21.74,9.26 21.74,12.9 23.18,14.34 24.23,14.34 29.59,19.7 29.59,44.06 31.28,45.75 v31.4,45.75 U$2.P$14
  Bottom 0.152: v31.4,45.75 30.98,45.75 29.31,47.42 23.74,47.42 19.99,51.17 14.54,51.17 SV5.25 | v24.68,5.8 24.75,5.8 J1.B32
B230_RX0_N  (via drill 0.3)
  Top 0.152: U$2.P$76 v35.76,54.06 v35.76,54.07 35.76,54.72 38.94,57.9 41.06,57.9 41.07,57.89 41.69,57.89 41.7,57.88 43.09,57.88 50.24,57.88 55.54,52.58 55.54,7.42 v53.95,5.83
  Bottom 0.152: SV1.13 32.92,76.25 34.21,74.96 34.21,73.5 36.13,71.58 36.13,55.08 35.76,54.71 v35.76,54.07 | v53.95,5.83 54.55,5.22 J1.B9
B230_RX0_P  (via drill 0.3)
  Top 0.152: U$2.P$77 v35.26,54.49 35.26,54.66 38.83,58.23 41.52,58.23 41.56,58.19 41.82,58.19 43.22,58.19 43.22,58.18 50.37,58.18 55.84,52.71 55.84,6.49 v55.19,5.84
  Bottom 0.152: SV1.14 33.53,73.73 35.77,71.49 35.77,55.14 35.26,54.63 v35.26,54.49 | v55.19,5.84 J1.B8
B230_TX0_N  (via drill 0.3)  (1 unrouted)
  Top 0.152: 29.48,6.79 29.48,9.39 32.34,12.24 32.34,37.7 34.75,40.1 34.75,40.88 v34.76,40.89 U$2.P$23 | 29.48,6.79 29.48,6.76 | 29.48,6.79 v28.53,5.83
  Bottom 0.152: v34.76,40.89 34.76,39.36 26.51,31.11 21.18,31.11 13.91,38.38 11.91,38.38 SV5.16 | J1.B29 v28.53,5.83
B230_TX0_P  (via drill 0.3)  (1 unrouted)
  Top 0.152: v29.79,5.85 29.79,9.26 32.65,12.12 32.65,37.4 35.26,40.02 v35.26,40.46 U$2.P$24
  Bottom 0.152: v35.26,40.46 35.26,39.42 26.64,30.8 21.05,30.8 14.52,37.33 SV5.15 | v29.79,5.85 J1.B28
B230_TX1_N  (via drill 0.3)  (1 unrouted)
  Top 0.152: v39.76,40.92 39.76,40.76 | 39.76,40.76 39.76,40.29 35.41,35.94 35.41,7.19 34.91,6.69 v34.91,5.85 v34.92,5.85 | U$2.P$33 39.76,40.76
  Bottom 0.152: v39.76,40.92 39.77,40.91 39.77,39.9 27.71,27.85 18.96,27.85 17.49,26.38 14.09,26.38 13.65,25.94 12.17,25.94 SV5.6 | v34.92,5.85 34.27,5.21 J1.B25
B230_TX1_P  (via drill 0.3)
  Top 0.152: v36.13,5.83 v36.13,5.82 35.71,6.24 35.71,35.81 40.26,40.36 v40.26,40.47 v40.25,40.48 U$2.P$34
  Bottom 0.152: v40.26,40.47 40.26,39.96 27.84,27.54 19.09,27.54 16.47,24.92 13.69,24.92 SV5.5 | v36.13,5.83 J1.B24
GND  (via drill 0.3)
  Top 0.305: U$2.P$5 32.95,50.25 v33.34,50.64 v33.34,50.65 | U$2.P$65 41.27,53.33 41.27,53.15 v41.73,52.7 | U$2.P$59 44.75,51.75 v45.02,51.48 | U$2.P$39 v42.75,40.94 v42.76,40.93
  Bottom 0.152: J1.K39 J1.J38 J1.H39 | J1.H39 J1.J40 | J1.H39 J1.G38 | J1.F39 J1.E38 J1.D39 J1.E40 | J1.E35 J1.F36 J1.G35 J1.H36 J1.J35 J1.K36 | J1.C40 J1.B39 | J1.B39 J1.A40 | J1.B39 J1.B38 | J1.B38 J1.C38 J1.D37 J1.C36 J1.D35 J1.C34 | J1.B38 J1.A37 | J1.B35 J1.B34 J1.C34 | J1.C34 J1.C33 J1.C32 | J1.C32 J1.B31 J1.B30 | J1.K33 J1.J32 | J1.J32 J1.H33 | J1.F33 J1.G32 25.34,12.05 25.89,12.6 25.89,13.05 25.34,13.6 J1.J32 | J1.E32 25.34,8.52 25.89,7.97 25.89,7.52 25.34,6.97 J1.C32 | J1.A28 J1.B27 | J1.B27 J1.C28 | J1.C28 J1.C29 | J1.C28 J1.D28 J1.E29 J1.F30 J1.G29 J1.H30 J1.J29 J1.K30 | J1.K27 J1.J26 J1.H27 J1.G26 J1.F27 | J1.E26 33.46,9.02 34.01,9.56 34.78,9.56 J1.F24 | J1.F24 J1.E23 J1.D22 J1.C21 | J1.F24 J1.G23 J1.H24 J1.J23 J1.K24 | J1.D25 J1.C25 | J1.C25 J1.C24 | J1.C25 J1.B26 J1.B27 | J1.A24 J1.B23 J1.B22 | J1.B22 J1.C21 | J1.C21 J1.C20 | J1.C20 J1.B19 | J1.B19 J1.A20 | J1.A21 J1.B22 | J1.C20 J1.D19 J1.E20 J1.F21 J1.G20 J1.H21 | J1.J20 J1.K21 | J1.B19 J1.B18 J1.A17 | J1.A16 J1.B15 | J1.B15 J1.C16 | J1.C16 J1.C17 | J1.C16 J1.D16 J1.E17 | J1.F18 J1.G17 J1.H18 43.12,13.32 42.58,13.87 42.58,14.32 43.12,14.87 J1.K18 J1.J17 | J1.K15 J1.J14 J1.H15 J1.G14 J1.F15 J1.E14 J1.D13 J1.C13 J1.C12 J1.B11 | J1.B11 J1.A12 | J1.A13 J1.B14 J1.B15 | J1.B11 J1.B10 J1.A9 | J1.A8 J1.B7 | J1.B7 J1.C8 J1.C9 J1.D10 J1.E11 J1.F12 J1.G11 J1.H12 J1.J11 J1.K12 | J1.K9 J1.J8 J1.H9 J1.G8 J1.F9 J1.E8 J1.D7 J1.D6 | J1.D6 J1.C5 | J1.C5 J1.B6 | J1.B6 J1.B7 | J1.B6 J1.A5 | J1.A4 J1.B3 | J1.B3 J1.B2 | J1.B2 J1.A1 | J1.B2 J1.C1 J1.D2 | J1.D2 J1.E1 J1.F2 | J1.D2 J1.D3 | J1.D3 J1.C4 | J1.C4 J1.B3 | J1.C4 J1.C5 | J1.D6 J1.E5 | J1.E5 J1.F6 J1.G5 | J1.E5 J1.E4 | J1.E4 J1.D3 | J1.E4 J1.F3 | J1.F2 J1.F3 | J1.F2 J1.G1 | J1.F3 J1.G4 | J1.G4 J1.G5
  Bottom 0.152: J1.G5 J1.H6 J1.J5 | J1.G4 J1.H3 J1.J4 | J1.J1 J1.K2 | J1.K3 J1.J4 | J1.J4 J1.J5 | J1.J5 J1.K6
  other vias: 37.51,48.5 38.54,48.48 39.52,48.48 37.5,47.5 38.49,47.5 39.5,47.5 39.51,46.49 38.51,46.5 37.51,46.51
  pour Bottom (isolate 0.254): 5,0 5,38 4,39 1,39 0,40 0,96.04 74,96.04 74,0
  pour Top (isolate 0.254): 5,0 5,38 4,39 1,39 0,40 0,96 74,96 74,0
VADJ  (via drill 0.65)
  Top 0.61: JP1.1 63.27,63.73 69,58 69,16 63,10 63,5 59.33,1.32 20,1.32 14,7.33 14,9.32 v13.98,9.34
  Bottom 0.152: J1.G39 | 16.23,9.23 J1.E39
  Bottom 0.254: J1.G39 J1.F40 16.23,9.23 | J1.G39 J1.H40
  Bottom 0.61: v13.98,9.34 14.93,10.29 J1.F40
VDD_CORE  (via drill 0.35, 0.65)
  Top 0.203: VDD_CORE.1 12,69 17,69 18,70 C5.1
  Top 0.305: U$2.P$6 32.66,49.73 33.52,49.73 34,50.21 v34,52 | v39.19,50.72 v39.2,50.73 43.34,50.73 43.86,51.25 U$2.P$58
  Top 0.61: C5.1 22.91,71 30.59,63.32 30.59,55.41 v31,55
  Top 1.016: VDD.P$1 28,82.8 C1.1 21.2,74.2 C5.1
  Bottom 0.61: v39.19,50.72 35.28,50.72 v34,52 v31,55
VDD_IO  (via drill 0.35, 0.65)
  Top 0.203: C6.1 59.05,69.95 62.95,69.95 VDD_IO.1
  Top 0.305: v42.27,43.96 42.25,43.94 U$2.P$38 | U$2.P$66 40.73,53.33 40.73,52.61 41.76,51.58 v42.29,51.58
  Top 0.61: v47,63 47,64 51,68 55,68 C6.1 58,69.16 60.89,66.27 JP1.2
  Top 1.016: U$4.P$1 64,80.8 C2.1 58,74.8 C6.1
  Bottom 0.61: v47,63 47,56.28 42.67,51.95 42.66,51.95 v42.29,51.58 v42.28,51.57 v42.28,43.97 v42.27,43.96

### Text on the board
tNames: GND | VDD_CORE | GND | VDD_IO | IOPAD[0] | IOPAD[2] | IOPAD[4] | IOPAD[6] | IOPAD[8] | IOPAD[10] | IOPAD[12] | PROG_CLK_PAD[0] | PSET_PAD[0] | GND | GND | GND | IOPAD[1] | IOPAD[3] | IOPAD[5] | IOPAD[7] | IOPAD[9] | IOPAD[11] | IOPAD[13] | PRESET_PAD[0] | GND | DEBUG_LUT[1] | DEBUG_LUT[2] | DEBUG_LUT[0] | IOPAD[55] | IOPAD[54] | DO NOT OPERATE / WITHOUT CUSTOM / CLPD FIRMWARE | IOPAD[53] | IOPAD[52] | GND | CLK_PAD[0] | IOPAD[51] | DB_SCNCHN[1] | IOPAD[50] | DB_SCNCHN[0] | IOPAD[49] | IOPAD[48] | IOPAD[27] | IOPAD[26] | IOPAD[47] | IOPAD[25] | IOPAD[46] | IOPAD[24] | IOPAD[45] | IOPAD[44] | IOPAD[23] | IOPAD[22] | IOPAD[43] | IOPAD[21] | IOPAD[42] | IOPAD[20] | IOPAD[28] | IOPAD[29] | IOPAD[19] | IOPAD[18] | IOPAD[30] | IOPAD[17] | IOPAD[31] | IOPAD[16] | IOPAD[32] | IOPAD[15] | IOPAD[33] | IOPAD[34] | IOPAD[14] | IOPAD[35] | IOPAD[36] | IOPAD[37] | IOPAD[38] | IOPAD[39] | IOPAD[40] | IOPAD[41] | RESET[0] | SET_PAD[0] | SC_IN[0] | GND | GF130nm testbed V2.11 | February 2021